# Altium project VisionBETA.PrjPcb (part 1 of 2)
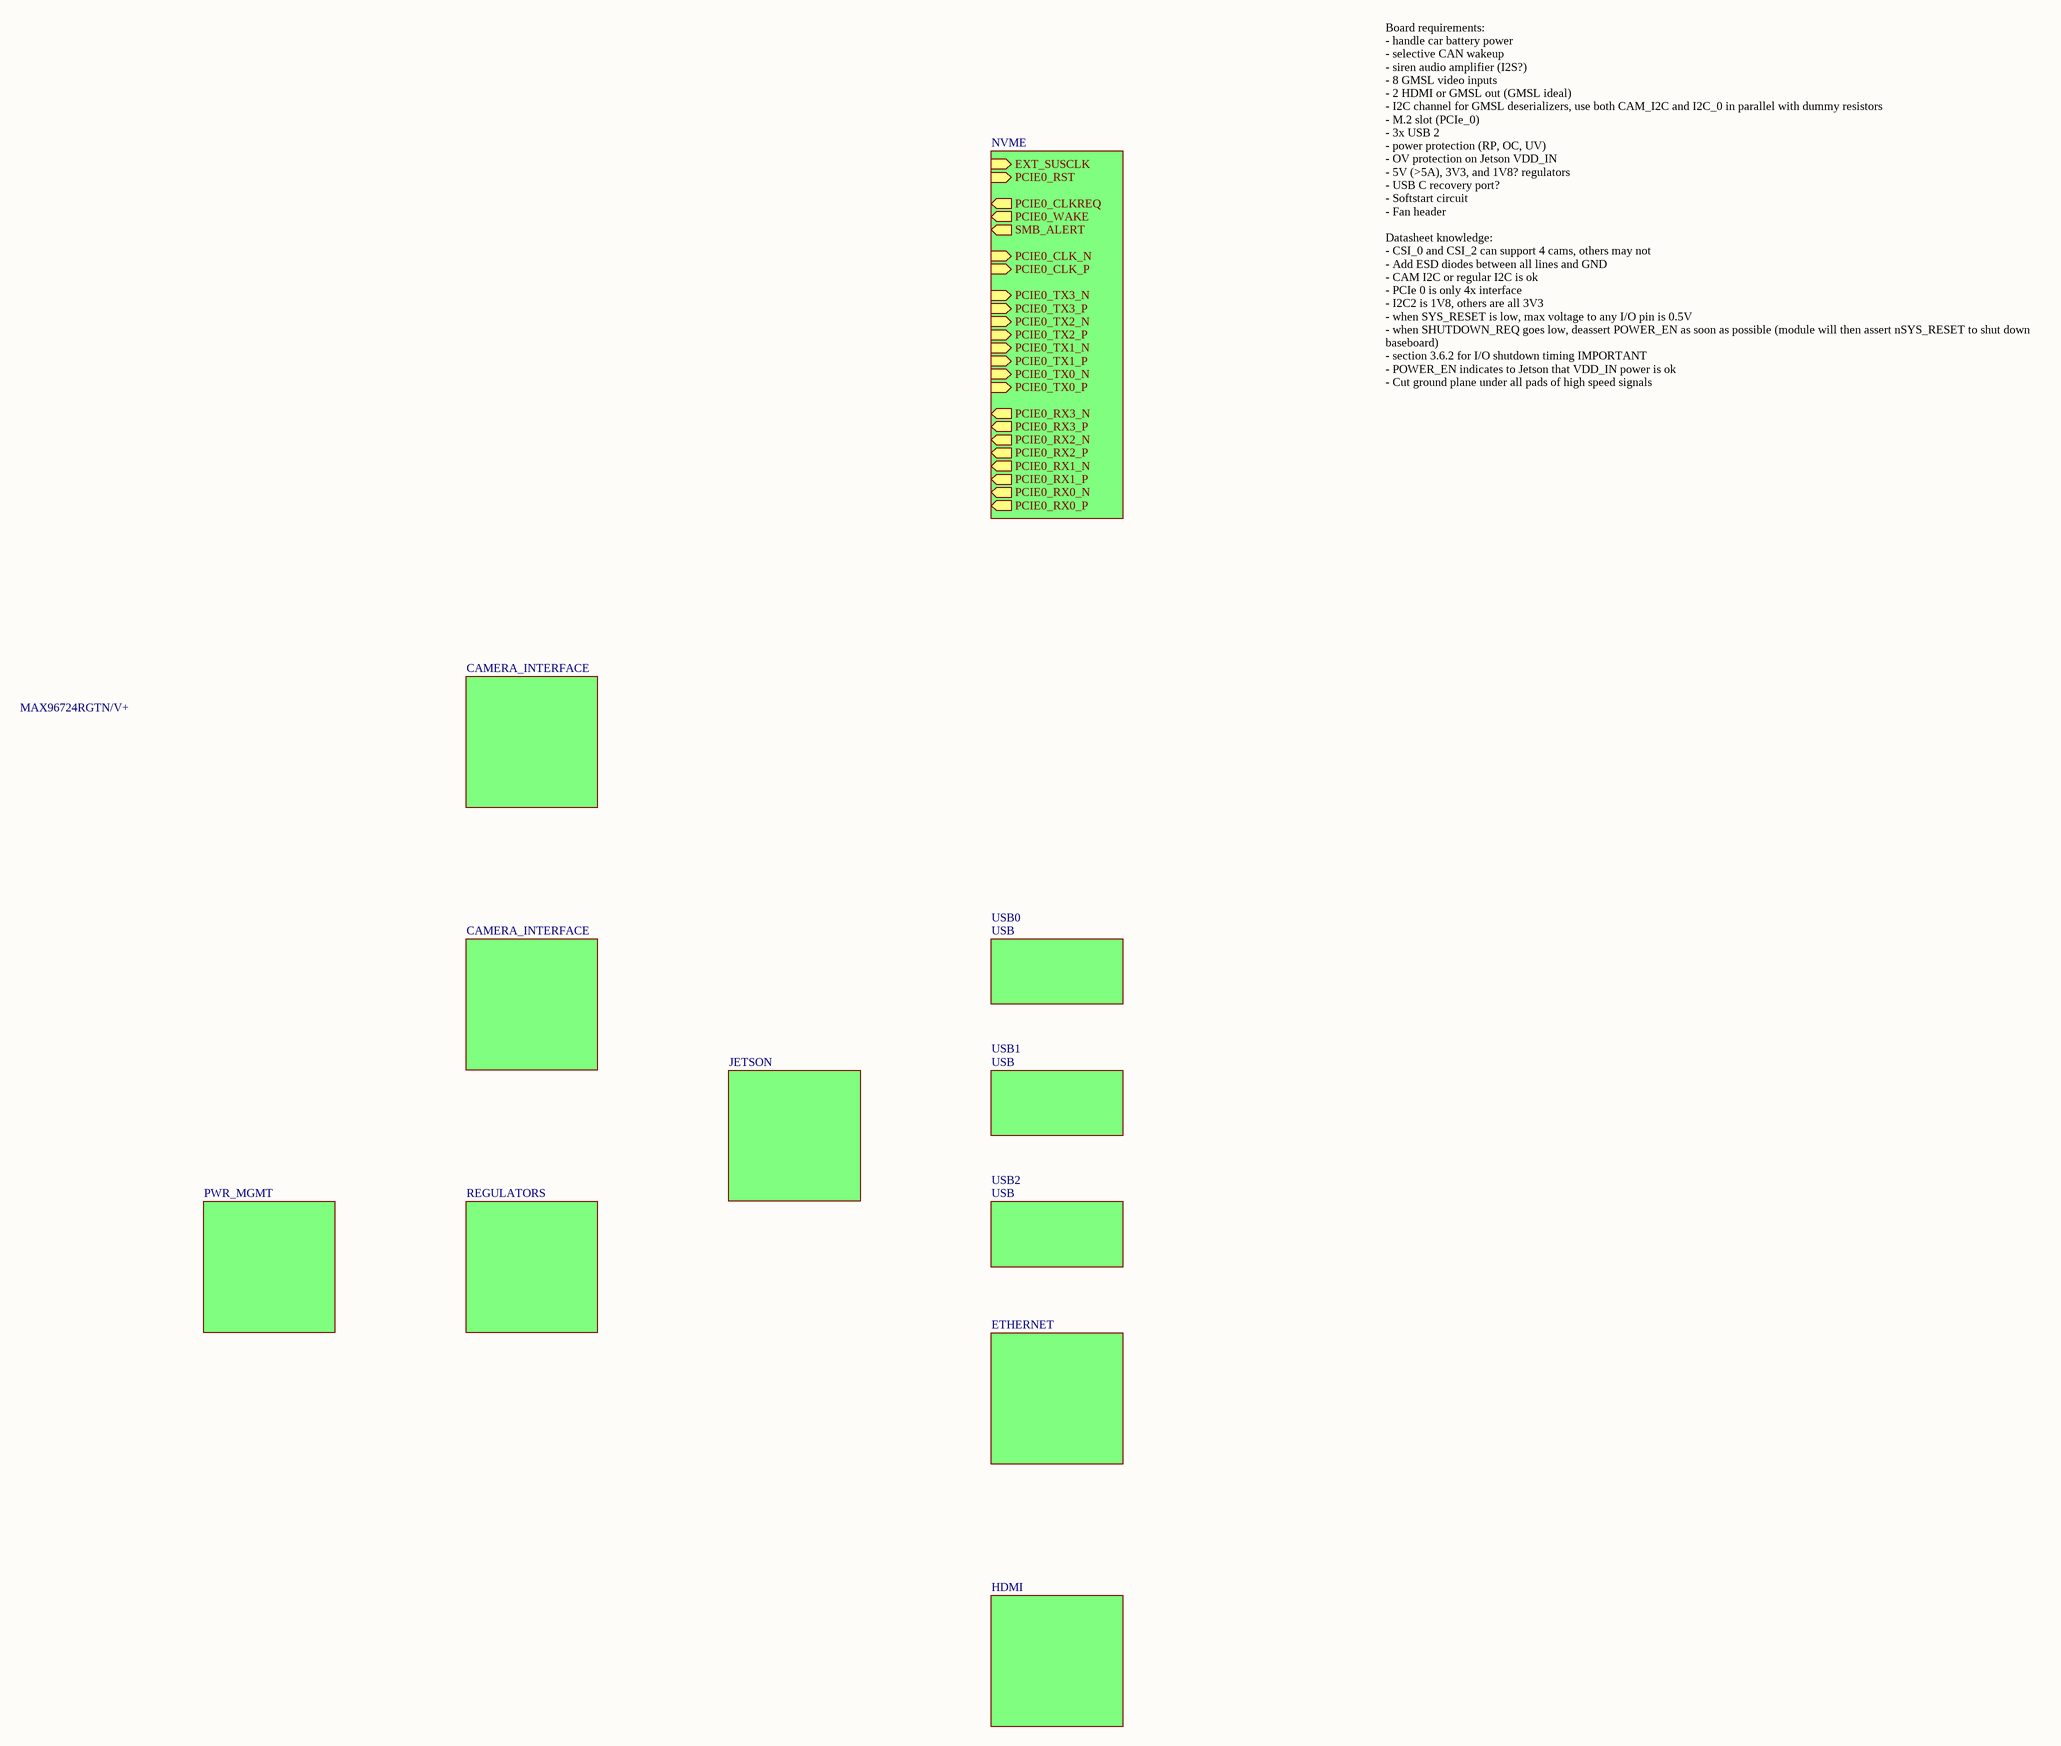
[diagram p0: VisionBETA.SchDoc]
6 sheets, 191 parts. Net scope: hierarchical (ports join the sheet entries above them; power ports are global).
Sheets:
  VisionBETA.SchDoc
    PWR_MGMT = PWR_MGMT.SchDoc
    CAMIF_0 = CAMERA_INTERFACE.SchDoc
    JETSON = JETSON.SchDoc
    USB0 = USB.SchDoc
    USB1 = USB.SchDoc
    USB2 = USB.SchDoc
    NVME = NVME.SchDoc
    CAMIF_1 = CAMERA_INTERFACE.SchDoc

## Sheet VisionBETA.SchDoc
size C; SheetNumber: 1; SheetTotal: 9

### Sub-sheets
CAMIF_0 = CAMERA_INTERFACE: no entries
CAMIF_1 = CAMERA_INTERFACE: no entries
ETH0 = ETHERNET (file not in this document): no entries
HDMI_0 = HDMI (file not in this document): no entries
JETSON = JETSON: no entries
NVME = NVME: EXT_SUSCLK (in), PCIE0_RST (in), PCIE0_CLKREQ (out), PCIE0_WAKE (out), SMB_ALERT (out), PCIE0_CLK_N (in), PCIE0_CLK_P (in), PCIE0_TX3_N (in), PCIE0_TX3_P (in), PCIE0_TX2_N (in), PCIE0_TX2_P (in), PCIE0_TX1_N (in), PCIE0_TX1_P (in), PCIE0_TX0_N (in), PCIE0_TX0_P (in), PCIE0_RX3_N (out), PCIE0_RX3_P (out), PCIE0_RX2_N (out), PCIE0_RX2_P (out), PCIE0_RX1_N (out), PCIE0_RX1_P (out), PCIE0_RX0_N (out), PCIE0_RX0_P (out)
PWR_MGMT = PWR_MGMT: no entries
REGULATORS = REGULATORS (file not in this document): no entries
USB0 = USB: no entries
USB1 = USB: no entries
USB2 = USB: no entries

### Notes on the sheet
- MAX96724RGTN/V+
- Board requirements:
  - handle car battery power
  - selective CAN wakeup
  - siren audio amplifier (I2S?)
  - 8 GMSL video inputs
  - 2 HDMI or GMSL out (GMSL ideal)
  - I2C channel for GMSL deserializers, use both CAM_I2C and I2C_0 in parallel with dummy resistors
  - M.2 slot (PCIe_0)
  - 3x USB 2
  - power protection (RP, OC, UV)
  - OV protection on Jetson VDD_IN
  - 5V (>5A), 3V3, and 1V8? regulators
  - USB C recovery port?
  - Softstart circuit
  - Fan header
  Datasheet knowledge:
  - CSI_0 and CSI_2 can support 4 cams, others may not
  - Add ESD diodes between all lines and GND
  - CAM I2C or regular I2C is ok
  - PCIe 0 is only 4x interface
  - I2C2 is 1V8, others are all 3V3
  - when SYS_RESET is low, max voltage to any I/O pin is 0.5V
  - when SHUTDOWN_REQ goes low, deassert POWER_EN as soon as possible (module will then assert nSYS_RESET to shut down baseboard)
  - section 3.6.2 for I/O shutdown timing IMPORTANT
  - POWER_EN indicates to Jetson that VDD_IN power is ok
  - Cut ground plane under all pads of high speed signals

## Sheet PWR_MGMT.SchDoc
size C; SheetNumber: 2; SheetTotal: 2
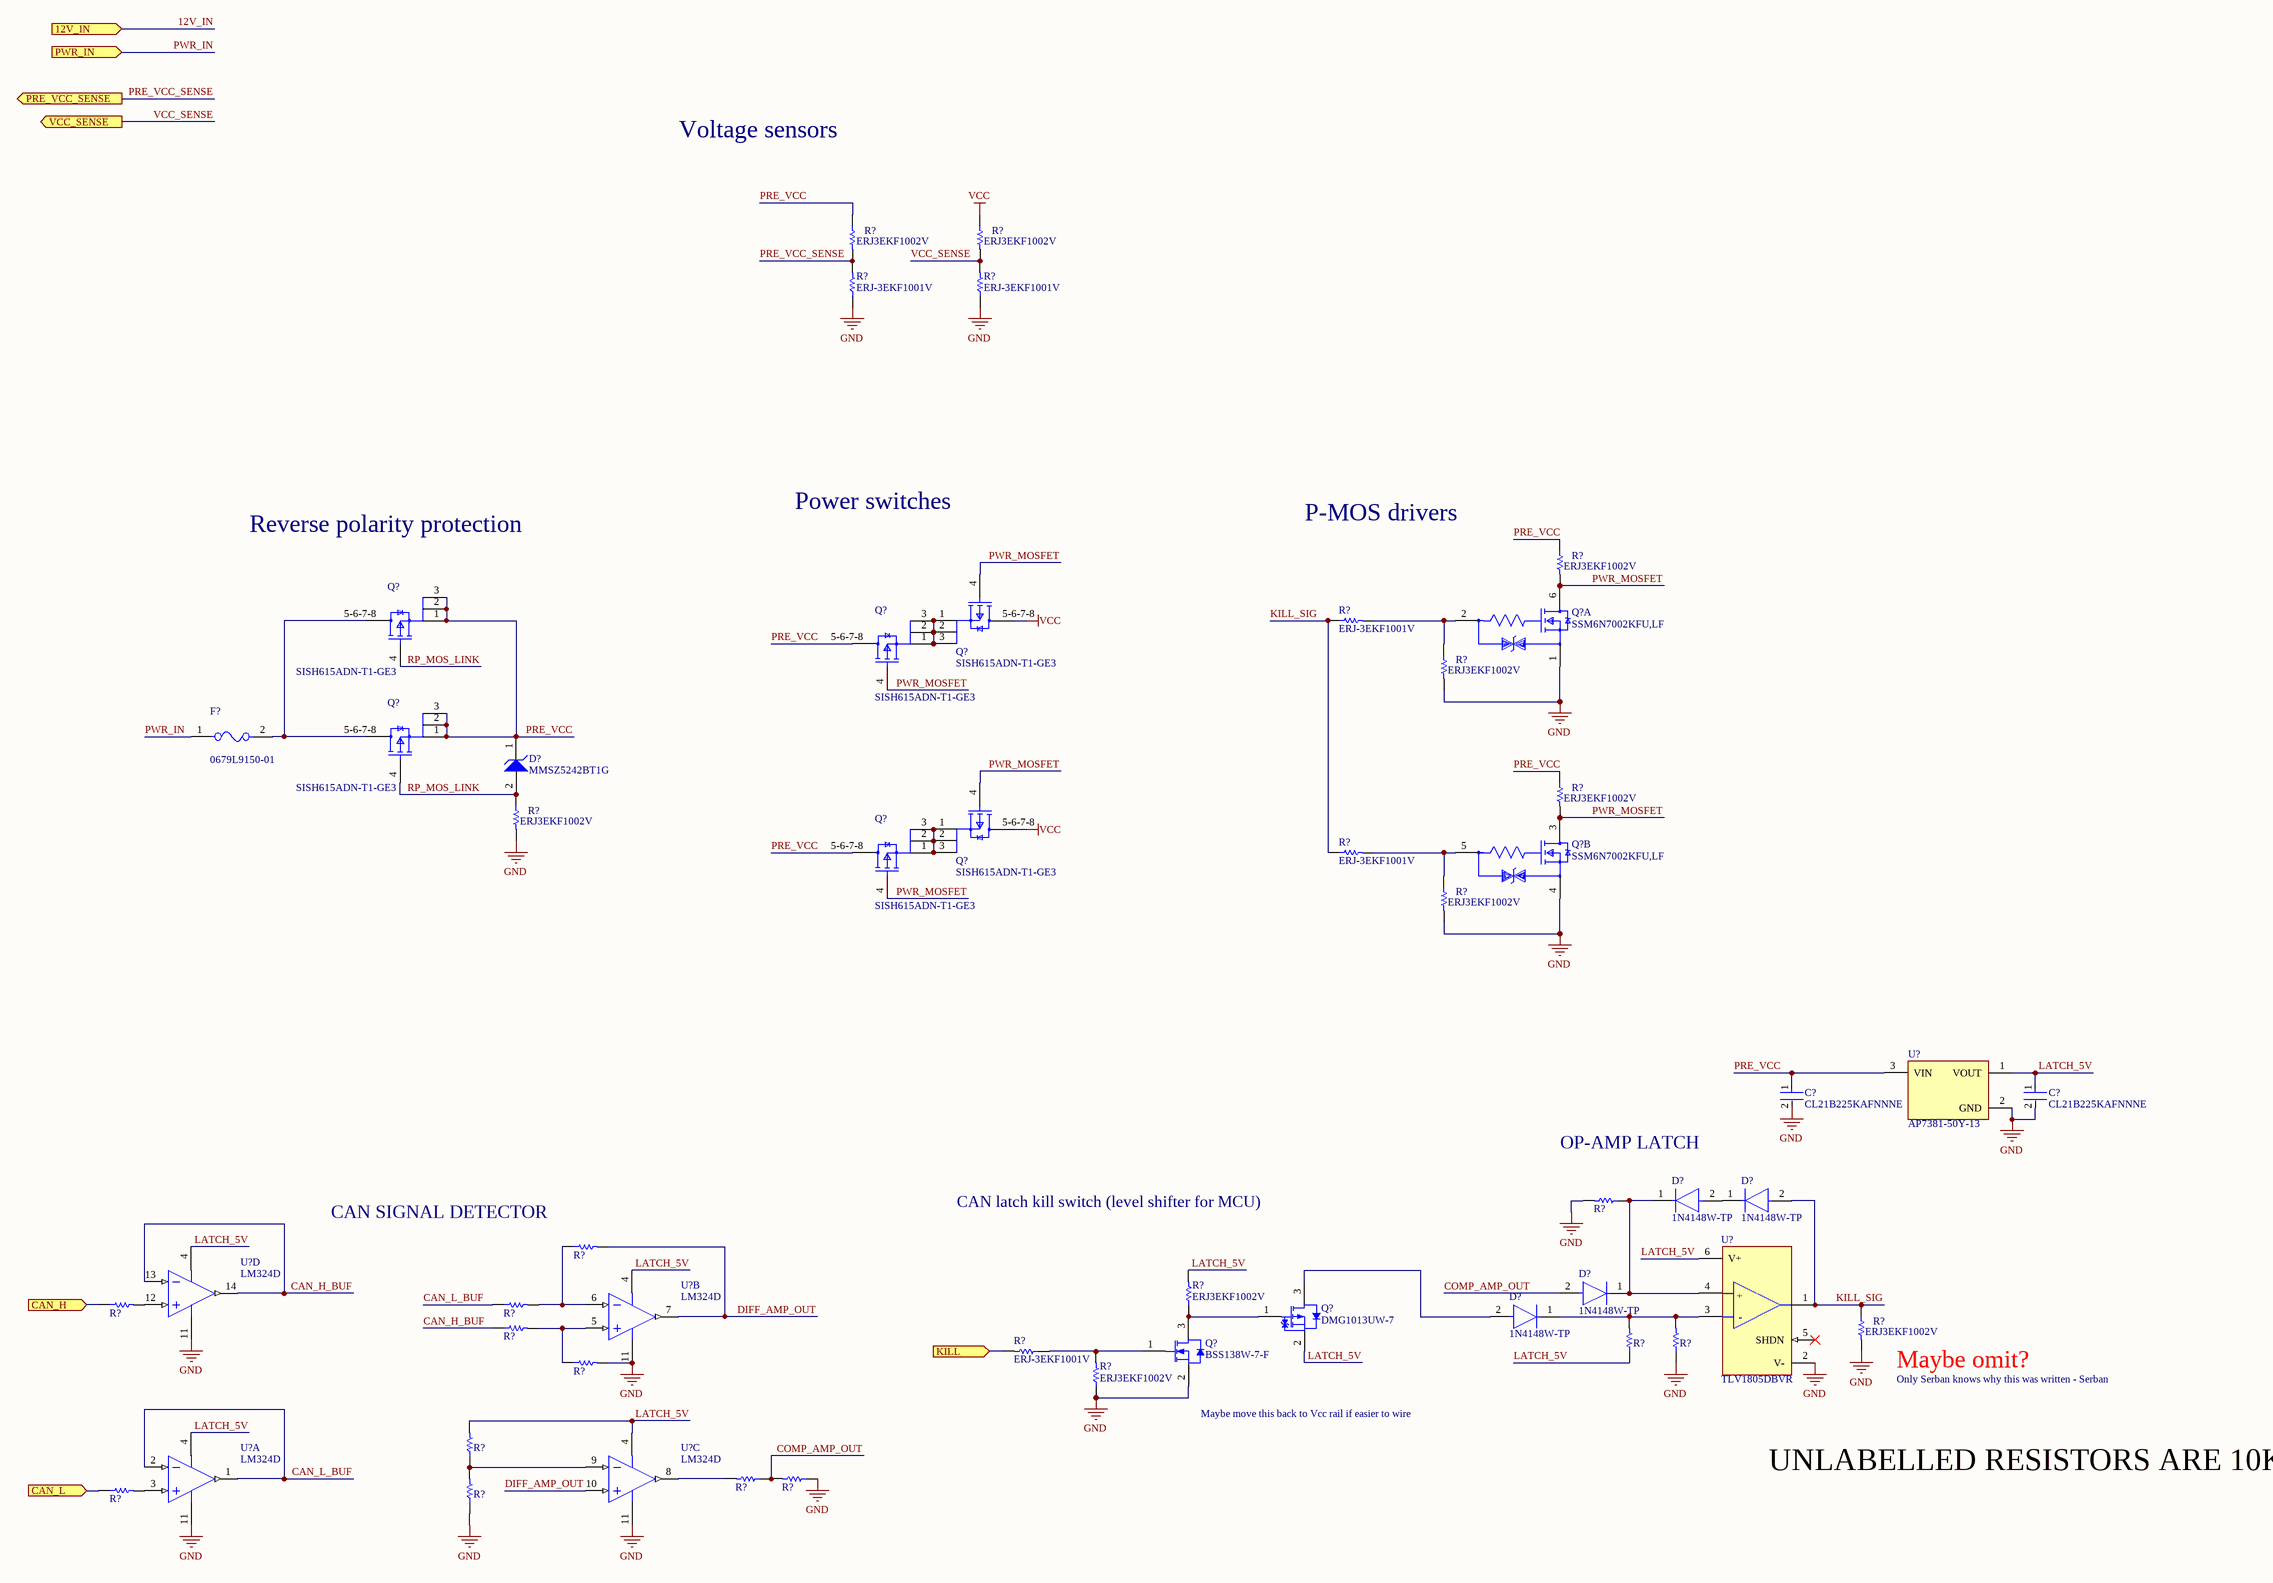
[diagram p1: PWR_MGMT.SchDoc]

### Parts
(Parts that share a designator on the sheet are numbered #1, #2 ... from top to bottom, then left to right.)
C?#1  CL21B225KAFNNNE  [FP-0805-L_2_01_0_2-W_1_25-IPC_B]
C?#2  CL21B225KAFNNNE  [FP-0805-L_2_01_0_2-W_1_25-IPC_B]
D?#1  MMSZ5242BT1G  [ONSC-SOD-123-2-425-04_V]
D?#2  1N4148W-TP  [FP-SOD-123-IPC_A]
D?#3  1N4148W-TP  [FP-SOD-123-IPC_A]
D?#4  1N4148W-TP  [FP-SOD-123-IPC_A]
D?#5  1N4148W-TP  [FP-SOD-123-IPC_A]
F?  0679L9150-01  [FP-0679L-MFG]
Q?#1  SISH615ADN-T1-GE3  [SISH615ADN-T1-GE3-Footprint-1]
Q?#2  SSM6N7002KFU,LF  [FP-SSOP6-P-0_65A-MFG]  (part A of 2)
Q?#3  SISH615ADN-T1-GE3  [SISH615ADN-T1-GE3-Footprint-1]
Q?#4  SISH615ADN-T1-GE3  [SISH615ADN-T1-GE3-Footprint-1]
Q?#5  SISH615ADN-T1-GE3  [SISH615ADN-T1-GE3-Footprint-1]
Q?#6  SISH615ADN-T1-GE3  [SISH615ADN-T1-GE3-Footprint-1]
Q?#7  SSM6N7002KFU,LF  [FP-SSOP6-P-0_65A-MFG]  (part B of 2)
Q?#8  SISH615ADN-T1-GE3  [SISH615ADN-T1-GE3-Footprint-1]
Q?#9  DMG1013UW-7  [DIOD-SOT323-3_V]
Q?#10  BSS138W-7-F  [DIOD-SOT323-3_V]
R?#1  ERJ3EKF1002V  [RESC1609X55X30LL15T15]
R?#2  ERJ3EKF1002V  [RESC1609X55X30LL15T15]
R?#3  ERJ-3EKF1001V  [RESC1608X55X30LL15T15]
R?#4  ERJ-3EKF1001V  [RESC1608X55X30LL15T15]
R?#5  ERJ3EKF1002V  [RESC1609X55X30LL15T15]
R?#6  ERJ-3EKF1001V  [RESC1608X55X30LL15T15]
R?#7  ERJ3EKF1002V  [RESC1609X55X30LL15T15]
R?#8  ERJ3EKF1002V  [RESC1609X55X30LL15T15]
R?#9  ERJ3EKF1002V  [RESC1609X55X30LL15T15]
R?#10  ERJ-3EKF1001V  [RESC1608X55X30LL15T15]
R?#11  ERJ3EKF1002V  [RESC1609X55X30LL15T15]
R?#12  ERJ3EKF1002V  [RESC1609X55X30LL15T15]  (value not drawn)
R?#13  ERJ3EKF1002V  [RESC1609X55X30LL15T15]  (value not drawn)
R?#14  ERJ3EKF1002V  [RESC1609X55X30LL15T15]  (value not drawn)
R?#15  ERJ3EKF1002V  [RESC1609X55X30LL15T15]  (value not drawn)
R?#16  ERJ3EKF1002V  [RESC1609X55X30LL15T15]
R?#17  ERJ3EKF1002V  [RESC1609X55X30LL15T15]
R?#18  ERJ3EKF1002V  [RESC1609X55X30LL15T15]  (value not drawn)
R?#19  ERJ3EKF1002V  [RESC1609X55X30LL15T15]  (value not drawn)
R?#20  ERJ3EKF1002V  [RESC1609X55X30LL15T15]  (value not drawn)
R?#21  ERJ3EKF1002V  [RESC1609X55X30LL15T15]  (value not drawn)
R?#22  ERJ-3EKF1001V  [RESC1608X55X30LL15T15]
R?#23  ERJ3EKF1002V  [RESC1609X55X30LL15T15]
R?#24  ERJ3EKF1002V  [RESC1609X55X30LL15T15]  (value not drawn)
R?#25  ERJ3EKF1002V  [RESC1609X55X30LL15T15]  (value not drawn)
R?#26  ERJ3EKF1002V  [RESC1609X55X30LL15T15]  (value not drawn)
R?#27  ERJ3EKF1002V  [RESC1609X55X30LL15T15]  (value not drawn)
R?#28  ERJ-3EKF1001V  [RESC1608X55X30LL15T15]  (value not drawn)
U?#1  AP7381-50Y-13  [FP-SOT89-MFG]
U?#2  TLV1805DBVR  [FP-DBV0006A-IPC_C]
U?#3  LM324D  [D0014A_L]  (part D of 4)
U?#4  LM324D  [D0014A_L]  (part B of 4)
U?#5  LM324D  [D0014A_L]  (part A of 4)
U?#6  LM324D  [D0014A_L]  (part C of 4)

### Ports
12V_IN (in), CAN_H (in), CAN_L (in), KILL (in), PRE_VCC_SENSE (out), PWR_IN (in), VCC_SENSE (out)

### Nets
GND: C?#1.2 C?#2.2 Q?#2.1(Source1) Q?#7.4(Source2) Q?#10.2(S) R?#3.1 R?#4.1 R?#7.2 R?#9.2 R?#11.2 R?#12.2 R?#17.2 R?#20.1 R?#21.2 R?#23.1 R?#26.1 R?#28.1 U?#1.2(GND) U?#2.2(V-) U?#3.11(GND) U?#4.11(GND) U?#5.11(GND) U?#6.11(GND)
VCC: Q?#1.5-6-7-8(D) Q?#6.5-6-7-8(D) R?#2.1
12V_IN: port 12V_IN
CAN_H_BUF: R?#18.1 U?#3.13(4IN-) U?#3.14(4OUT)
CAN_L_BUF: R?#15.1 U?#5.1(1OUT) U?#5.2(1IN-)
COMP_AMP_OUT: D?#4.2(A) R?#25.1 R?#26.2
DIFF_AMP_OUT: R?#13.2 U?#4.7(2OUT) U?#6.10(3IN+)
KILL_SIG: D?#3.2(A) R?#6.1 R?#10.1 R?#17.1 U?#2.1(OUT)
LATCH_5V: C?#2.1 Q?#9.2(S) R?#16.2 R?#19.1 R?#24.2 U?#1.1(VOUT) U?#2.6(V+) U?#3.4(VCC) U?#4.4(VCC) U?#5.4(VCC) U?#6.4(VCC)
PRE_VCC: C?#1.1 D?#1.1(K) Q?#3.1(S) Q?#3.2(S) Q?#3.3(S) Q?#4.5-6-7-8(D) Q?#5.1(S) Q?#5.2(S) Q?#5.3(S) Q?#8.5-6-7-8(D) R?#1.1 R?#5.1 R?#8.1 U?#1.3(VIN)
PRE_VCC_SENSE: R?#1.2 R?#3.2 ; port PRE_VCC_SENSE
PWR_IN: F?.1 ; port PWR_IN
PWR_MOSFET: Q?#1.4(G) Q?#2.6(Drain1) Q?#4.4(G) Q?#6.4(G) Q?#7.3(Drain2) Q?#8.4(G) R?#5.2 R?#8.2
RP_MOS_LINK: D?#1.2(A) Q?#3.4(G) Q?#5.4(G) R?#9.1
VCC_SENSE: R?#2.2 R?#4.2 ; port VCC_SENSE
NetD?#2_1: D?#2.1(C) D?#4.1(C) R?#12.1 U?#2.4(+IN)
NetD?#2_2: D?#2.2(A) D?#3.1(C)
NetD?#5_1: D?#5.1(C) R?#19.2 R?#20.2 U?#2.3(-IN)
NetD?#5_2: D?#5.2(A) Q?#9.3(D)
NetF?_2: F?.2 Q?#3.5-6-7-8(D) Q?#5.5-6-7-8(D)
NetQ?#1_1: Q?#1.1(S) Q?#1.2(S) Q?#1.3(S) Q?#4.1(S) Q?#4.2(S) Q?#4.3(S)
NetQ?#2_2: Q?#2.2(Gate1) R?#6.2 R?#7.1
NetQ?#6_1: Q?#6.1(S) Q?#6.2(S) Q?#6.3(S) Q?#8.1(S) Q?#8.2(S) Q?#8.3(S)
NetQ?#7_5: Q?#7.5(Gate2) R?#10.2 R?#11.1
NetQ?#9_1: Q?#9.1(G) Q?#10.3(D) R?#16.1
NetQ?#10_1: Q?#10.1(G) R?#22.1 R?#23.2
NetR?#13_1: R?#13.1 R?#15.2 U?#4.6(2IN-)
NetR?#14_1: R?#14.1 ; port CAN_H
NetR?#14_2: R?#14.2 U?#3.12(4IN+)
NetR?#18_2: R?#18.2 R?#21.1 U?#4.5(2IN+)
NetR?#22_2: R?#22.2 ; port KILL
NetR?#24_1: R?#24.1 R?#28.2 U?#6.9(3IN-)
NetR?#25_2: R?#25.2 U?#6.8(3OUT)
NetR?#27_1: R?#27.1 ; port CAN_L
NetR?#27_2: R?#27.2 U?#5.3(1IN+)

Not connected (* = marked no-connect by the designer): U?#2 5(SHDN)*

### Notes on the sheet
- Voltage sensors
- Power switches
- Reverse polarity protection
- P-MOS drivers
- OP-AMP LATCH
- CAN latch kill switch (level shifter for MCU)
- CAN SIGNAL DETECTOR
- (near R?#17) Maybe omit?
- Only Serban knows why this was written - Serban
- Maybe move this back to Vcc rail if easier to wire
- UNLABELLED RESISTORS ARE 10K
- (in symbol CMP-04896-000098-1) +; -

### Library data of the parts
C?#1 C?#2 = CMP-2007-04514-2: Voltage Rating (DC): 25V; Tolerance: 10%; Capacitance: 2.2uF; Dielectric: X7R; RoHS Compliant: Yes; Lead Free: Lead Free; Packaging: Tape and Reel; Case Code (Imperial): 0805; Case/Package: 0805; Contact Plating: Tin; Mount: Surface Mount; Construction: Flat; Voltage: 25V; REACH SVHC: No SVHC; Thickness: 0.06inch; Depth: 1.25mm; Max Operating Temperature: 125°C; Package Quantity: 3000; Width: 0.049inch; Height: 1.52mm; Case Code (Metric): 2012; Number of Pins: 2; Termination: SMD/SMT; Voltage Rating: 25V; Radiation Hardening: No; Series: FlEXITERM; Length: 2.01mm; Min Operating Temperature: -55°C
D?#1 = CMP-1060-00565-1: Zener Voltage Regulator, 500 mW, 2-Pin SOD-123, Pb-Free, Tape and Reel; Manufacturer: On Semiconductor; P Max (W): 0.5; VZ Typ (V): 12; PartNumber: MMSZ5242BT1G; PackageReference: SOD-123-2-425-04; ComponentLink3URL: http://www.onsemi.com/pub_link/Collateral/425-04.PDF; Mounting Technology: Surface Mount; ComponentLink2Description: Datasheet; ComponentLink1URL: http://www.onsemi.com/; ComponentLink3Description: Package Specification; PackageDescription: 2-Pin SOD, Body 1.6 x 2.69 mm; PackageVersion: Rev. G, 10/2009; ComponentLink1Description: Manufacturer URL; RoHS: Pb-Free; ComponentLink2URL: http://www.onsemi.com/pub_link/Collateral/MMSZ5221BT1-D.PDF; Packing: Tape and Reel; DatasheetVersion: Rev. 12
D?#2-D?#5 = CMP-2000-04993-2: DIODE GEN PURP 100V 150MA SOD123; Max Reverse Leakage Current: 5uA; Max Surge Current: 2A; Reverse Recovery Time: 4ns; Polarity: Standard; Capacitance: 4pF; Max Forward Surge Current (Ifsm): 1A; Element Configuration: Single; Power Dissipation: 400mW; Forward Voltage: 1V; Radiation Hardening: No; Lead Free: Lead Free; Max Reverse Voltage (DC): 100V; Current Rating: 150mA; Forward Current: 150mA; Packaging: Tape and Reel; Number of Pins: 2; Package Quantity: 3000; Max Operating Temperature: 150°C; Min Operating Temperature: -65°C; Average Rectified Current: 150mA; Recovery Time: 4ns; Output Current: 150mA; Peak Non-Repetitive Surge Current: 2A; Width: 1.8mm; Voltage Rating (DC): 100V; Height: 1.2mm; Max Repetitive Reverse Voltage (Vrrm): 100V; Mount: Surface Mount; Length: 2.85mm
F? = CMP-16042-000002-1: FUSE BRD MNT 15A 125VAC/VDC; Manufacturer: Bel Fuse; Max Fuse Ac Voltage: 125V; Fuse Blow Speed: Fast; Fuse I2T: 103.5A2Sec; Fuse Interrupt Ac Current: 50A; Automotive Grade: Grade 1; Value: 0.0038Ω; Fuse Interrupt Dc Current: 300A; Fuse Voltage Drop: 0.13V; Device Class L2: Fuses; ComponentLink2URL: https://www.belfuse.com/resources/CircuitProtection/datasheets/0679L%20Sep2016.pdf; Package: 0679L; Height: 2.79mm; Digikey Description: FUSE BRD MNT 15A 125VAC/VDC; Temperature Range High: +125°C; Device Class L3: unset; Octopart: https://octopart.com/0679l9150-01-bel+fuse-70850665; Temperature Range Low: -55°C; Fuse Current: 15A; Max Fuse Dc Voltage: 125V; Ipc Land Pattern Name: CAPC610254X254; Manufacturer Part Number: 0679L9150-01; Category: Fuse; Lead Free: Yes; Automotive: Yes; Resistance: 0.0038Ω; RoHS: TRUE; Device Class L1: Circuit Protection; ComponentLink2Description: Datasheet; Temperature: -55°C to +125°C; Voltage Rating: 125V
Q?#1 Q?#3-Q?#6 Q?#8 = CMP-013-00036-2: Trans MOSFET P-CH 20V 22.1A 8-Pin PowerPAK 1212 EP T/R
Q?#2 Q?#7 = CMP-35916-000009-1: MOSFET 2N-CH 60V 0.3A; Input Capacitance: 40pF; Continuous Drain Current (ID): 300mA; Max Power Dissipation: 285mW; FET Type: 2 N-Channel; Rds On Max: 1.5R; Mount: Surface Mount; Drain to Source Voltage (Vdss): 60V; Packaging: Tape and Reel
Q?#9 = CMP-2000-06170-1: P-Channel Enhancement Mode MOSFET, 310 mW, 20 V, -55 to 150 degC, 3-Pin SOT-323, RoHS, Tape and Reel; Manufacturer: Diodes Inc; Qg Gate Charge: 0.622nC; Drain-Source On Resistance-Max: 750mO; Rated Power Dissipation: 310mW; Drain-to-Source Voltage [Vdss]: 20V; Package Reference: SOT323; Datasheet Version: Rev. 3-2, 09/2013; Package Description: 3-Pin Small Outline Transistor, Body 2 x 1.25 mm, Pitch 0.65 mm; Mounting Technology: SurfaceMount; Manufacturer URL: http://www.diodes.com/; Datasheet URL: http://www.diodes.com/_files/datasheets/ds31861.pdf; Channel Type: P-Channel
Q?#10 = CMP-2000-05968-1: N-Channel Enhancement Mode Mosfet, 50 V, 200 mA, -55 to 150 degC, 6-Pin SOT-323, RoHS, Tape and Reel; Typical Turn-Off Delay Time: 20ns; Number of Channels: 1Channel; Type: EnhancementModeFieldEffectTransistor; Brand: DiodesIncorporated; Vds - Drain-Source Breakdown Voltage: 75V; Vgs - Gate-Source Voltage: 20V; Rds On - Drain-Source Resistance: 1.4Ohms; Transistor Type: 1N-Channel; Configuration: Single; Unit Weight: 0.000212oz; Pd - Power Dissipation: 200mW; Id - Continuous Drain Current: 200mA; Forward Transconductance - Min: 0.1S; Manufacturer URL: http://www.diodes.com/; Series: BSS138; Package Description: 3-Pin Small Outline Transistor, Body 2 x 1.25 mm, Pitch 0.65 mm; Mounting Technology: SurfaceMount; Product Category: MOSFET; RoHS: True; Maximum Operating Temperature: +150C; Height: 1mm; Length: 2.2mm; Technology: Si; Width: 1.35mm; Datasheet URL: http://www.diodes.com/_files/datasheets/ds30206.pdf; Manufacturer: DiodesIncorporated; Package / Case: SOT-323-3; Typical Turn-On Delay Time: 20ns; Transistor Polarity: N-Channel; Factory Pack Quantity: 3000; Packaging: Reel; Product: MOSFETSmallSignal; Datasheet Version: Rev. 11-2, 09/2013; Package Reference: SOT323; Minimum Operating Temperature: -55C; Mounting Style: SMD/SMT; Channel Mode: Enhancement
R?#1 R?#2 R?#5 R?#7-R?#9 R?#11-R?#21 R?#23-R?#27 = CMP-1012-00623-3: Chip Resistor, 10 KOhm, +/- 1%, 0.1 W, -55 to 155 degC, 0603 (1608 Metric), RoHS, Tape and Reel; Manufacturer: Panasonic; Voltage Rating: 75V; Case\/Package: 0603; Power Rating: 100mW; Resistance: 10KOhm; Temperature Coefficient: 100ppm\/degreesC; Number of Pins: 2; Package Reference: 603; Depth: 0.8mm; Mount: SurfaceMount; Package Description: 2-Pin Surface Mount Device, Body 1.6 x 0.85 mm; Datasheet Version: 02/2017; Length: 1.6mm; Lead Free: LeadFree; Height: 0.45mm; Number of Terminations: 2; Max Power Dissipation: 100mW; Min Operating Temperature: -55degC; Datasheet URL: https://industrial.panasonic.com/cdbs/www-data/pdf/RDA0000/AOA0000C304.pdf; Termination: SMD/SMT; Case Code (Metric): 1608; Case Code (Imperial): 0603; Tolerance: 1%; Max Operating Temperature: 155degC; RoHSCompliant: true; Voltage Rating (DC): 75V; Radiation Hardening: No; Packaging: TapeandReel; Composition: ThickFilm; Mounting Technology: SurfaceMount; Manufacturer URL: http://www.panasonic.com/; Width: 0.031inch; REACH SVHC: NoSVHC; Contact Plating: Tin; Military Standard: Not; Package Quantity: 1
R?#3 R?#4 R?#6 R?#10 R?#22 R?#28 = CMP-2000-00180-1: Manufacturer: Panasonic; Part Number: ERJ-3EKF1001V
U?#1 = CMP-12756-000009-1: IC REG LINEAR 5V 150MA SOT89; Manufacturer: Diodes Inc.; Output Type: Fixed; Min Supply Voltage: 3.3V; Max Junction Temp: +125°C; Max Supply Voltage: 40V; Nominal Supply Current: 2.5-25uA; Number Of Outputs: 1; Dropout Voltage: 1000mV; Manufacturer Part Number: AP7381-50Y-13; RoHS: TRUE; Digikey Description: IC REG LINEAR 5V 150MA SOT89; Output Voltage: 5V; Footprint Url: https://www.diodes.com/assets/Package-Files/SOT89.pdf; Category: IC; Temperature: -40°C to +125°C; ComponentLink2Description: Datasheet; Package: SOT89; Temperature Range Low: -40°C; Temperature Range High: +125°C; ComponentLink2URL: https://www.diodes.com/assets/Datasheets/AP7381.pdf; Device Class L1: Integrated Circuits (ICs); Automotive: No; Output Current: 150mA; Ambient Temperature Range High: +85°C; Octopart: https://octopart.com/ap7381-50y-13-diodes+inc.-87775116; Lead Free: Yes; Device Class L2: Power Management ICs; Height: 1.6mm; Device Class L3: Voltage Regulators - Linear; Ambient Temperature Range Low: -40°C
U?#2 = CMP-04896-000098-1: 40V, RAIL-TO-RAIL INPUT, PUSH-PU
U?#3-U?#6 = CMP-2000-06547-1: Quadruple Operational Amplifier, 0.5 V/us, 1.2 MHz, 3 to 32 V, 0 to 70 degC, 14-Pin SOIC (D), Green (RoHS & no Sb/Br), Tube; Manufacturer: Texas Instruments; Unity Gain Bandwidth Product: 1.2MHz; Input Offset Voltage: 7mV; Dual Supply Voltage (Max): ±16V; Single Supply Voltage (Min): 3V; Single Supply Voltage (Max): 32V; Voltage Gain in dB: 100dB; Power Supply Requirement: Single/Dual; Input Bias Current: 250nA; Dual Supply Voltage (Min): ±1.5V; Single Supply Voltage (Typ): 5/9/12/15/18/24/28V; Dual Supply Voltage (Typ): ±3/±5/±9/±12/±15V; Number of  Elements: 4; Common Mode Rejection Ratio: 65dB; Datasheet Version: Rev. W, 03/2015; Technology: Bipolar; Shut Down Feature: No; Package Reference: D0014A; Type: GeneralPurposeAmplifier; Pin Count: 14; Package Type: SOIC; Rail/Rail I/O Type: No; Manufacturer URL: http://www.ti.com/; Package Description: 14-Pin Small Outline Integrated Circuit, Body 8.65 x 3.9 mm, Pitch 1.27 mm; Operating Temperature Classification: Commercial; Datasheet URL: http://www.ti.com/lit/ds/symlink/lm324.pdf; Slew Rate: 0.5V/us; Package URL: http://www.ti.com/lit/ml/mpds177g/mpds177g.pdf; Mounting: SurfaceMount; Packaging: Rail/Tube; Mounting Technology: SurfaceMount; Operating Temp Range: 0Cto70C

## Sheet CAMERA_INTERFACE.SchDoc
size C; SheetNumber: 4; SheetTotal: 8
Used 2 times, as channels CAMIF_0, CAMIF_1. Parts and nets are listed once, with the designators drawn on the sheet.
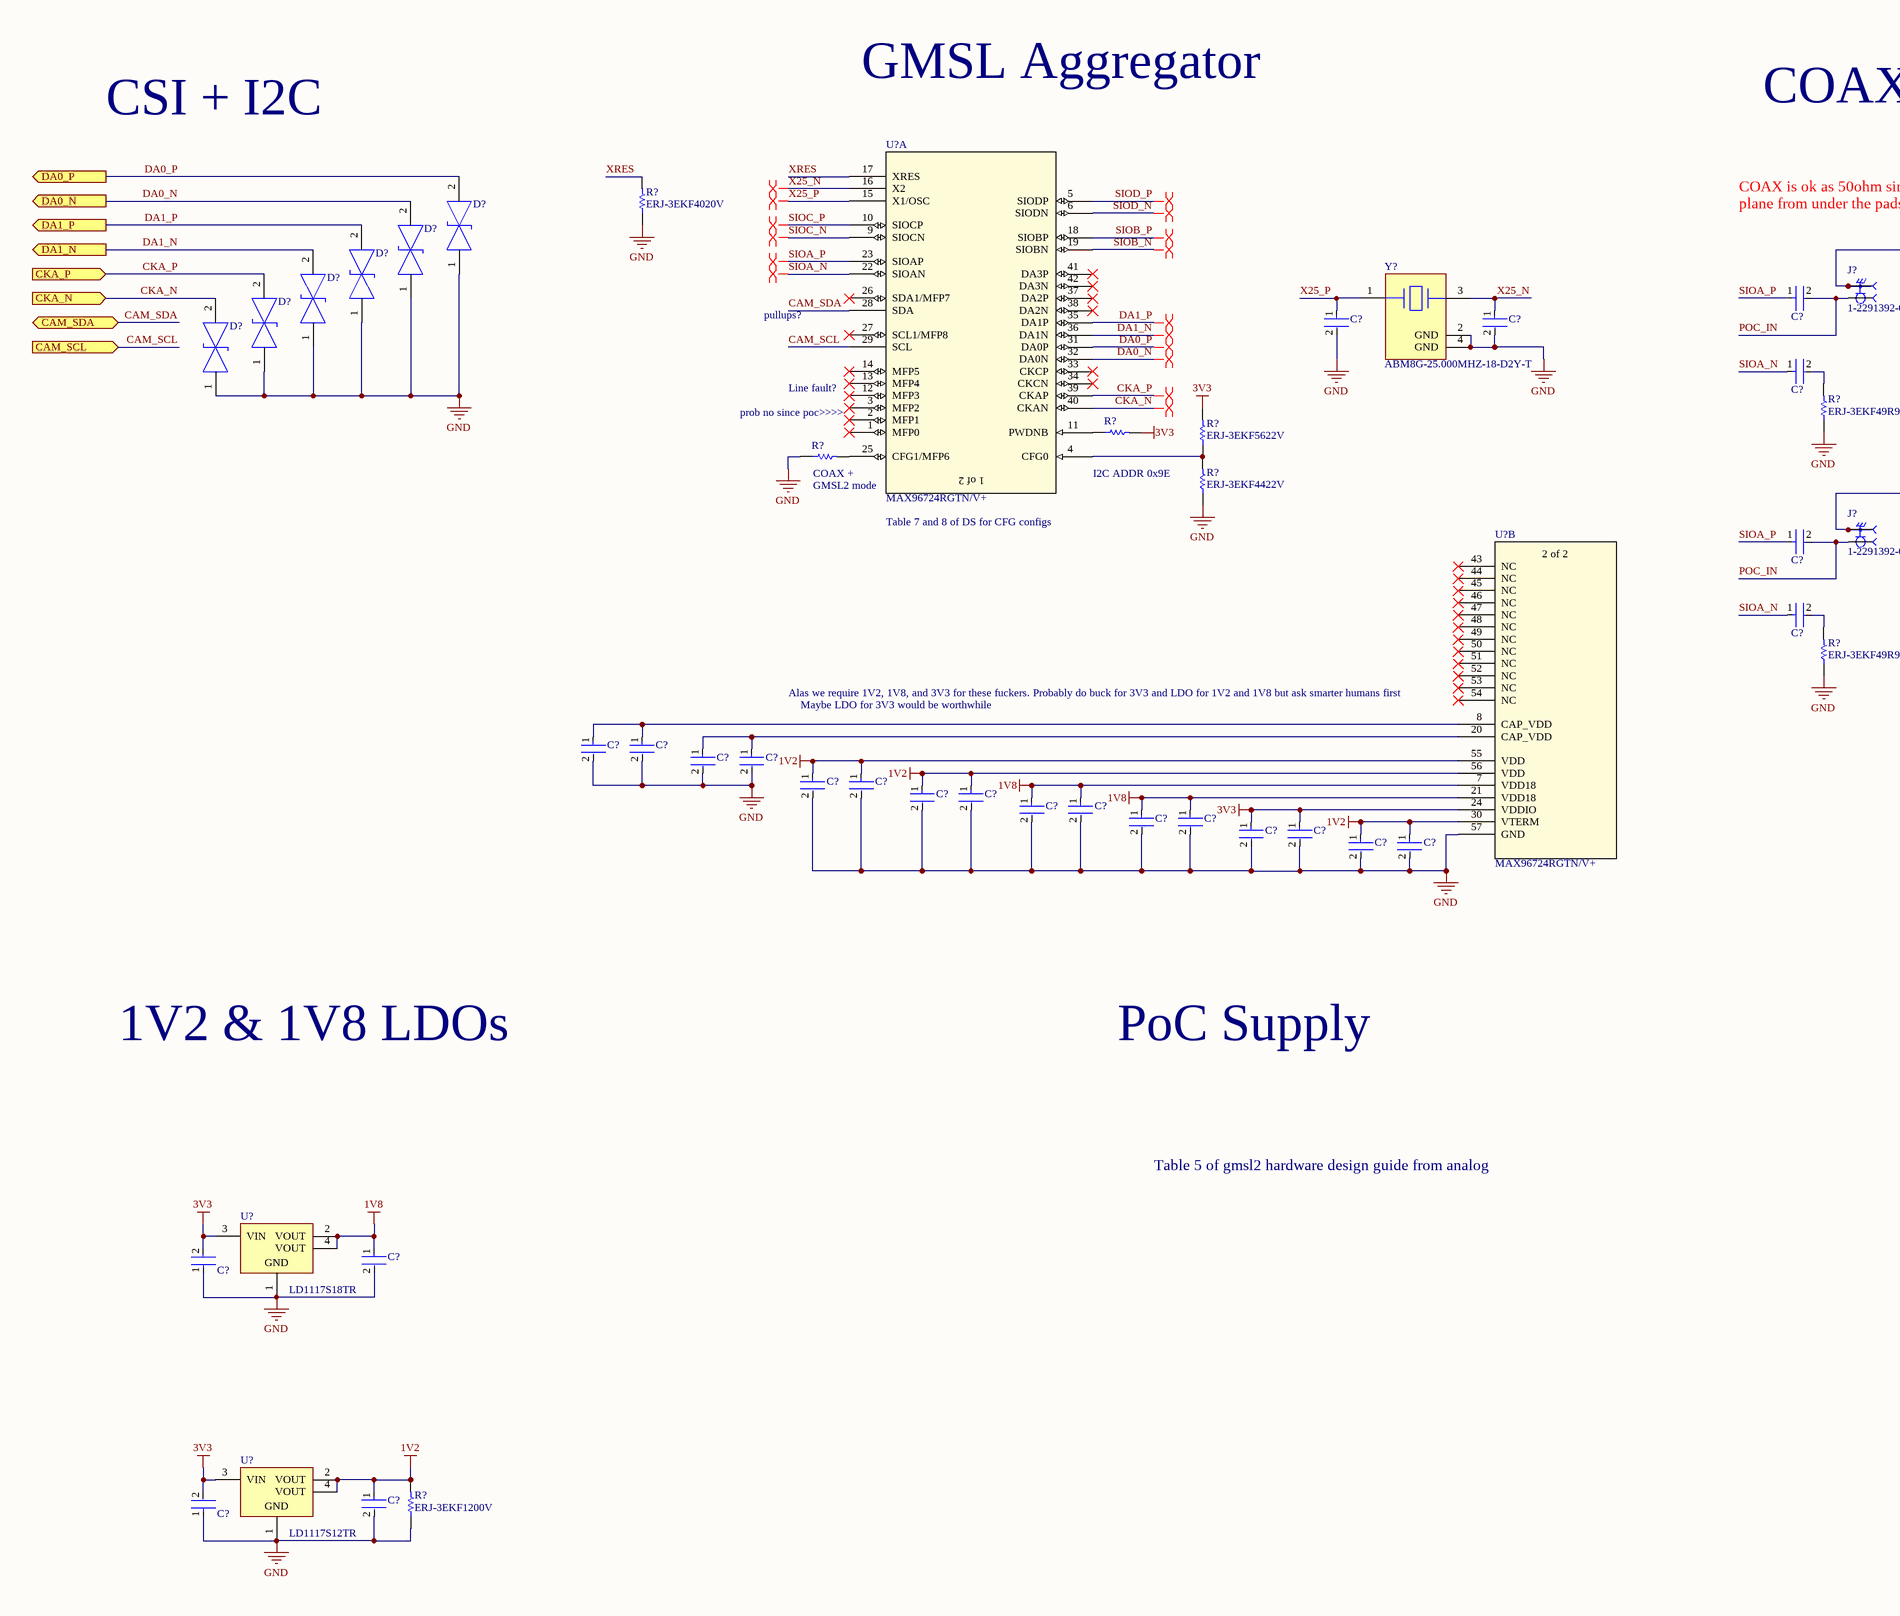
[diagram p2: CAMERA_INTERFACE.SchDoc, left]
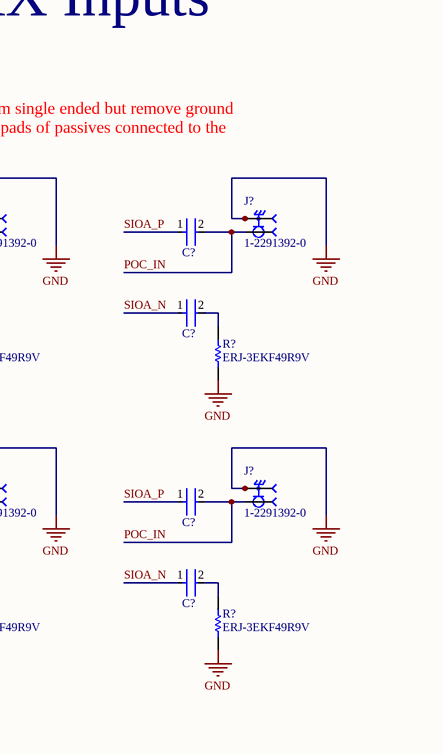
[diagram p3: CAMERA_INTERFACE.SchDoc, right]

### Parts
(Parts that share a designator on the sheet are numbered #1, #2 ... from top to bottom, then left to right.)
C?#1  C1005X7R1H104K050BB  [FP-C1005-050-0_05-IPC_C]  (value not drawn)
C?#2  C1005X7R1H104K050BB  [FP-C1005-050-0_05-IPC_C]  (value not drawn)
C?#3  C0603C300J5GACTU  [FP-C0603C-CF-MFG]  (value not drawn)
C?#4  C0603C300J5GACTU  [FP-C0603C-CF-MFG]  (value not drawn)
C?#5  C1005X7R1H104K050BB  [FP-C1005-050-0_05-IPC_C]  (value not drawn)
C?#6  C1005X7R1H104K050BB  [FP-C1005-050-0_05-IPC_C]  (value not drawn)
C?#7  C1005X7R1H104K050BB  [FP-C1005-050-0_05-IPC_C]  (value not drawn)
C?#8  C1005X7R1H104K050BB  [FP-C1005-050-0_05-IPC_C]  (value not drawn)
C?#9  C1005X7R1H104K050BB  [FP-C1005-050-0_05-IPC_C]  (value not drawn)
C?#10  C1005X7R1H104K050BB  [FP-C1005-050-0_05-IPC_C]  (value not drawn)
C?#11  GRM188R60J106ME47D  [FP-GRM188-0_1-e0_2_0_55-IPC_A]  (value not drawn)
C?#12  CC0603KRX7R8BB103  [FP-CC0603-DA-MFG]  (value not drawn)
C?#13  GRM188R60J106ME47D  [FP-GRM188-0_1-e0_2_0_55-IPC_A]  (value not drawn)
C?#14  CC0603KRX7R8BB103  [FP-CC0603-DA-MFG]  (value not drawn)
C?#15  GRM188R60J106ME47D  [FP-GRM188-0_1-e0_2_0_55-IPC_A]  (value not drawn)
C?#16  CC0603KRX7R8BB103  [FP-CC0603-DA-MFG]  (value not drawn)
C?#17  GRM188R60J106ME47D  [FP-GRM188-0_1-e0_2_0_55-IPC_A]  (value not drawn)
C?#18  CC0603KRX7R8BB103  [FP-CC0603-DA-MFG]  (value not drawn)
C?#19  GRM188R60J106ME47D  [FP-GRM188-0_1-e0_2_0_55-IPC_A]  (value not drawn)
C?#20  CC0603KRX7R8BB103  [FP-CC0603-DA-MFG]  (value not drawn)
C?#21  GRM188R60J106ME47D  [FP-GRM188-0_1-e0_2_0_55-IPC_A]  (value not drawn)
C?#22  CC0603KRX7R8BB103  [FP-CC0603-DA-MFG]  (value not drawn)
C?#23  GRM188R60J106ME47D  [FP-GRM188-0_1-e0_2_0_55-IPC_A]  (value not drawn)
C?#24  CC0603KRX7R8BB103  [FP-CC0603-DA-MFG]  (value not drawn)
C?#25  GRM188R60J106ME47D  [FP-GRM188-0_1-e0_2_0_55-IPC_A]  (value not drawn)
C?#26  CC0603KRX7R8BB103  [FP-CC0603-DA-MFG]  (value not drawn)
C?#27  GRM188R60J106ME47D  [FP-GRM188-0_1-e0_2_0_55-IPC_A]  (value not drawn)
C?#28  C1005X7R1H104K050BB  [FP-C1005-050-0_05-IPC_C]  (value not drawn)
C?#29  GRM188R60J106ME47D  [FP-GRM188-0_1-e0_2_0_55-IPC_A]  (value not drawn)
C?#30  C1005X7R1H104K050BB  [FP-C1005-050-0_05-IPC_C]  (value not drawn)
D?#1  ESD231B1W0201E6327XTSA1  [FP-SG-WLL-2-MFG]  (value not drawn)
D?#2  ESD231B1W0201E6327XTSA1  [FP-SG-WLL-2-MFG]  (value not drawn)
D?#3  ESD231B1W0201E6327XTSA1  [FP-SG-WLL-2-MFG]  (value not drawn)
D?#4  ESD231B1W0201E6327XTSA1  [FP-SG-WLL-2-MFG]  (value not drawn)
D?#5  ESD231B1W0201E6327XTSA1  [FP-SG-WLL-2-MFG]  (value not drawn)
D?#6  ESD231B1W0201E6327XTSA1  [FP-SG-WLL-2-MFG]  (value not drawn)
J?#1  1-2291392-0  [1-2291392-0-Footprint-1]
J?#2  1-2291392-0  [1-2291392-0-Footprint-1]
J?#3  1-2291392-0  [1-2291392-0-Footprint-1]
J?#4  1-2291392-0  [1-2291392-0-Footprint-1]
R?#1  ERJ-3EKF4020V  [RESC1608X55X30LL15T15]
R?#2  ERJ-3EKF49R9V  [RESC1608X55X30ML15T15]
R?#3  ERJ-3EKF49R9V  [RESC1608X55X30ML15T15]
R?#4  ERJ3EKF1002V  [RESC1609X55X30LL15T15]  (value not drawn)
R?#5  ERJ-3EKF5622V  [RESC1608X55X30LL15T15]
R?#6  ERJ3EKF1002V  [RESC1609X55X30LL15T15]  (value not drawn)
R?#7  ERJ-3EKF4422V  [RESC1608X55X30ML15T15]
R?#8  ERJ-3EKF49R9V  [RESC1608X55X30ML15T15]
R?#9  ERJ-3EKF49R9V  [RESC1608X55X30ML15T15]
R?#10  ERJ-3EKF1200V  [RESC1609X55X30ML15T15]
U?#1  MAX96724RGTN/V+  [QFN50P800X800X80_HS-57N]  (part A of 2)
U?#2  MAX96724RGTN/V+  [QFN50P800X800X80_HS-57N]  (part B of 2)
U?#3  LD1117S18TR  [SOT-223_M]
U?#4  LD1117S12TR  [SOT-223_M]
Y?  ABM8G-25.000MHZ-18-D2Y-T  [FP-ABM8G-MFG]

### Ports
CAM_SCL (in), CAM_SDA (bidir), CKA_N (in), CKA_P (in), DA0_N (out), DA0_P (out), DA1_N (out), DA1_P (out)

### Nets
1V2: C?#15.1 C?#16.1 C?#17.1 C?#18.1 C?#25.1 C?#26.1 C?#29.1 R?#10.2 U?#2.30(VTERM) U?#2.55(VDD) U?#2.56(VDD) U?#4.2(VOUT) U?#4.4(VOUT)
1V8: C?#19.1 C?#20.1 C?#21.1 C?#22.1 C?#27.1 U?#2.7(VDD18) U?#2.21(VDD18) U?#3.2(VOUT) U?#3.4(VOUT)
3V3: C?#23.1 C?#24.1 C?#28.2 C?#30.2 R?#4.2 R?#5.2 U?#2.24(VDDIO) U?#3.3(VIN) U?#4.3(VIN)
GND: C?#3.2 C?#4.2 C?#11.2 C?#12.2 C?#13.2 C?#14.2 C?#15.2 C?#16.2 C?#17.2 C?#18.2 C?#19.2 C?#20.2 C?#21.2 C?#22.2 C?#23.2 C?#24.2 C?#25.2 C?#26.2 C?#27.2 C?#28.1 C?#29.2 C?#30.1 D?#1.1 D?#2.1 D?#3.1 D?#4.1 D?#5.1 D?#6.1 J?#1.S1 J?#1.S2 J?#1.S3 J?#1.S4 J?#2.S1 J?#2.S2 J?#2.S3 J?#2.S4 J?#3.S1 J?#3.S2 J?#3.S3 J?#3.S4 J?#4.S1 J?#4.S2 J?#4.S3 J?#4.S4 R?#1.1 R?#2.1 R?#3.1 R?#6.1 R?#7.1 R?#8.1 R?#9.1 R?#10.1 U?#2.57(GND) U?#3.1(GND) U?#4.1(GND) Y?.2(GND) Y?.4(GND)
CAM_SCL: U?#1.29(SCL) ; port CAM_SCL
CAM_SDA: U?#1.28(SDA) ; port CAM_SDA
CKA_N: D?#6.2 U?#1.40(CKAN) ; port CKA_N
CKA_P: D?#5.2 U?#1.39(CKAP) ; port CKA_P
DA0_N: D?#2.2 U?#1.32(DA0N) ; port DA0_N
DA0_P: D?#1.2 U?#1.31(DA0P) ; port DA0_P
DA1_N: D?#4.2 U?#1.36(DA1N) ; port DA1_N
DA1_P: D?#3.2 U?#1.35(DA1P) ; port DA1_P
POC_IN: C?#1.2 C?#2.2 C?#7.2 C?#8.2 J?#1.1 J?#2.1 J?#3.1 J?#4.1
SIOA_N: C?#5.1 C?#6.1 C?#9.1 C?#10.1 U?#1.22(SIOAN)
SIOA_P: C?#1.1 C?#2.1 C?#7.1 C?#8.1 U?#1.23(SIOAP)
SIOB_N: U?#1.19(SIOBN)
SIOB_P: U?#1.18(SIOBP)
SIOC_N: U?#1.9(SIOCN)
SIOC_P: U?#1.10(SIOCP)
SIOD_N: U?#1.6(SIODN)
SIOD_P: U?#1.5(SIODP)
X25_N: C?#4.1 U?#1.16(X2) Y?.3
X25_P: C?#3.1 U?#1.15(X1/OSC) Y?.1
XRES: R?#1.2 U?#1.17(XRES)
NetC?#5_2: C?#5.2 R?#2.2
NetC?#6_2: C?#6.2 R?#3.2
NetC?#9_2: C?#9.2 R?#8.2
NetC?#10_2: C?#10.2 R?#9.2
NetC?#11_1: C?#11.1 C?#12.1 U?#2.8(CAP_VDD)
NetC?#13_1: C?#13.1 C?#14.1 U?#2.20(CAP_VDD)
NetR?#4_1: R?#4.1 U?#1.11(PWDNB)
NetR?#5_1: R?#5.1 R?#7.2 U?#1.4(CFG0)
NetR?#6_2: R?#6.2 U?#1.25(CFG1/MFP6)

Not connected (* = marked no-connect by the designer): U?#1 1(MFP0)* 2(MFP1)* 3(MFP2)* 12(MFP3)* 13(MFP4)* 14(MFP5)* 26(SDA1/MFP7)* 27(SCL1/MFP8)* 33(CKCP)* 34(CKCN)* 37(DA2P)* 38(DA2N)* 41(DA3P)* 42(DA3N)*; U?#2 43(NC)* 44(NC)* 45(NC)* 46(NC)* 47(NC)* 48(NC)* 49(NC)* 50(NC)* 51(NC)* 52(NC)* 53(NC)* 54(NC)*

### Channels
CAMIF_0: designators C?=C?_CAMIF_0#3 C?=C?_CAMIF_0#4 C?=C?_CAMIF_0#26 C?=C?_CAMIF_0#25 C?=C?_CAMIF_0#24 C?=C?_CAMIF_0#23 C?=C?_CAMIF_0#22 C?=C?_CAMIF_0#21 C?=C?_CAMIF_0#20 C?=C?_CAMIF_0#19 C?=C?_CAMIF_0#18 C?=C?_CAMIF_0#17 C?=C?_CAMIF_0#16 C?=C?_CAMIF_0#15 C?=C?_CAMIF_0#14 C?=C?_CAMIF_0#13 C?=C?_CAMIF_0#12 C?=C?_CAMIF_0#11 C?=C?_CAMIF_0#2 C?=C?_CAMIF_0#6 C?=C?_CAMIF_0#8 C?=C?_CAMIF_0#10 C?=C?_CAMIF_0#1 C?=C?_CAMIF_0#5 C?=C?_CAMIF_0#7 C?=C?_CAMIF_0#9 C?=C?_CAMIF_0#28 C?=C?_CAMIF_0#30 C?=C?_CAMIF_0#27 C?=C?_CAMIF_0#29 D?=D?_CAMIF_0#6 D?=D?_CAMIF_0#5 D?=D?_CAMIF_0#4 D?=D?_CAMIF_0#3 D?=D?_CAMIF_0#2 D?=D?_CAMIF_0#1 J?=J?_CAMIF_0#2 J?=J?_CAMIF_0#4 J?=J?_CAMIF_0#1 J?=J?_CAMIF_0#3 R?=R?_CAMIF_0#1 R?=R?_CAMIF_0#5 R?=R?_CAMIF_0#7 R?=R?_CAMIF_0#6 R?=R?_CAMIF_0#4 R?=R?_CAMIF_0#3 R?=R?_CAMIF_0#9 R?=R?_CAMIF_0#2 R?=R?_CAMIF_0#8 R?=R?_CAMIF_0#10 U?=U?_CAMIF_0#1 U?=U?_CAMIF_0#2 U?=U?_CAMIF_0#4 U?=U?_CAMIF_0#3 Y?=Y?_CAMIF_0; ports CAM_SCL=CAM_SCL_CAMIF_0 CAM_SDA=CAM_SDA_CAMIF_0 CKA_N=CKA_N_CAMIF_0 CKA_P=CKA_P_CAMIF_0 DA0_N=DA0_N_CAMIF_0 DA0_P=DA0_P_CAMIF_0 DA1_N=DA1_N_CAMIF_0 DA1_P=DA1_P_CAMIF_0
CAMIF_1: designators C?=C?_CAMIF_1#3 C?=C?_CAMIF_1#4 C?=C?_CAMIF_1#26 C?=C?_CAMIF_1#25 C?=C?_CAMIF_1#24 C?=C?_CAMIF_1#23 C?=C?_CAMIF_1#22 C?=C?_CAMIF_1#21 C?=C?_CAMIF_1#20 C?=C?_CAMIF_1#19 C?=C?_CAMIF_1#18 C?=C?_CAMIF_1#17 C?=C?_CAMIF_1#16 C?=C?_CAMIF_1#15 C?=C?_CAMIF_1#14 C?=C?_CAMIF_1#13 C?=C?_CAMIF_1#12 C?=C?_CAMIF_1#11 C?=C?_CAMIF_1#2 C?=C?_CAMIF_1#6 C?=C?_CAMIF_1#8 C?=C?_CAMIF_1#10 C?=C?_CAMIF_1#1 C?=C?_CAMIF_1#5 C?=C?_CAMIF_1#7 C?=C?_CAMIF_1#9 C?=C?_CAMIF_1#28 C?=C?_CAMIF_1#30 C?=C?_CAMIF_1#27 C?=C?_CAMIF_1#29 D?=D?_CAMIF_1#6 D?=D?_CAMIF_1#5 D?=D?_CAMIF_1#4 D?=D?_CAMIF_1#3 D?=D?_CAMIF_1#2 D?=D?_CAMIF_1#1 J?=J?_CAMIF_1#2 J?=J?_CAMIF_1#4 J?=J?_CAMIF_1#1 J?=J?_CAMIF_1#3 R?=R?_CAMIF_1#1 R?=R?_CAMIF_1#5 R?=R?_CAMIF_1#7 R?=R?_CAMIF_1#6 R?=R?_CAMIF_1#4 R?=R?_CAMIF_1#3 R?=R?_CAMIF_1#9 R?=R?_CAMIF_1#2 R?=R?_CAMIF_1#8 R?=R?_CAMIF_1#10 U?=U?_CAMIF_1#1 U?=U?_CAMIF_1#2 U?=U?_CAMIF_1#4 U?=U?_CAMIF_1#3 Y?=Y?_CAMIF_1; ports CAM_SCL=CAM_SCL_CAMIF_1 CAM_SDA=CAM_SDA_CAMIF_1 CKA_N=CKA_N_CAMIF_1 CKA_P=CKA_P_CAMIF_1 DA0_N=DA0_N_CAMIF_1 DA0_P=DA0_P_CAMIF_1 DA1_N=DA1_N_CAMIF_1 DA1_P=DA1_P_CAMIF_1

### Layout directives
differential pair: CKA_N_CAMIF_0, CKA_P_CAMIF_0, DA0_N_CAMIF_0, DA0_P_CAMIF_0, DA1_N_CAMIF_0, DA1_P_CAMIF_0, SIOA_N_CAMIF_0, SIOA_P_CAMIF_0, SIOB_N_CAMIF_0, SIOB_P_CAMIF_0, SIOC_N_CAMIF_0, SIOC_P_CAMIF_0, SIOD_N_CAMIF_0, SIOD_P_CAMIF_0, X25_N_CAMIF_0, X25_P_CAMIF_0

### Notes on the sheet
- CSI + I2C
- GMSL Aggregator
- COAX Inputs
- COAX is ok as 50ohm single ended but remove ground plane from under the pads of passives connected to the GMSL trace
- pullups?
- prob no since poc>>>>
- (near U?#1) Line fault?
- GMSL2 mode
- (near R?#6) COAX +
- (near R?#4) I2C ADDR 0x9E
- Table 7 and 8 of DS for CFG configs
- (near U?#2) Alas we require 1V2, 1V8, and 3V3 for these fuckers. Probably do buck for 3V3 and LDO for 1V2 and 1V8 but ask smarter humans first
- Maybe LDO for 3V3 would be worthwhile
- 1V2 & 1V8 LDOs
- PoC Supply
- Table 5 of gmsl2 hardware design guide from analog
- (in symbol CMP-015-00011-2, part A) 1 of 2
- (in symbol CMP-015-00011-2, part B) 2 of 2

### Library data of the parts
C?#1 C?#2 C?#5-C?#10 C?#28 C?#30 = CMP-2000-05393-2: Multilayer Ceramic Capacitors 100nF ±10% 50V X7R SMD 0402; Voltage: 50V; Dielectric Material: Ceramic; Min Operating Temperature: -55°C; Depth: 0.5mm; Radiation Hardening: No; RoHS Compliant: Yes; Voltage Rating (DC): 50V; Lead Free: Lead Free; Resistor Type: Ceramic; Height: 0.5mm; Dielectric: X7R; Thickness: 0.022inch; Case/Package: 0402; Case Code (Metric): 1005; Termination: SMD/SMT; Capacitance: 100nF; Packaging: Tape and Reel; Max Operating Temperature: 125°C; Mount: Surface Mount; Package Quantity: 1; Width: 0.02inch; Weight: 2.3E-05oz; Voltage Rating: 50V; Tolerance: 10%; Construction: Flat; Case Code (Imperial): 0402; Length: 1mm; REACH SVHC: No SVHC; Series: C
C?#3 C?#4 = CMP-1035-00914-3: CAP CER 30PF 50V 5% NP0 0603; Manufacturer: KEMET; Automotive Grade: Grade 1; Temperature Coefficient: 30ppm/°C; Material: Ceramic; Temperature Characteristic: C0G; Tolerance: 0.05; Description: C0603 30 pF C0G 30ppm/°C 5.00% 50 V; Manufacturer Part Number: C0603C300J5GACTU; ComponentLink2URL: https://api.kemet.com/component-edge/download/datasheet/C0603C100J5GACAUTO.pdf; Automotive: Yes; Device Class L2: Capacitors; Device Class L1: Passive Components; Device Class L3: Ceramic Capacitors; RoHS: TRUE; Octopart: https://octopart.com/c0603c300j5gactu-kemet-199455; Lead Free: Yes; Value: 30 pF; Temperature Range High: +125°C; Category: Cap; Temperature: -55°C to +125°C; Package: C0603C-CF; Capacitance: 30 pF; Digikey Description: CAP CER 30PF 50V 5% NP0 0603; Height: 0.87mm; ComponentLink2Description: Datasheet; Temperature Range Low: -55°C; Mouser Description: Multilayer Ceramic Capacitors MLCC - SMD/SMT 50volts 30pF C0G 5%; Voltage Rating: 50 V
C?#11 C?#13 C?#15 C?#17 C?#19 C?#21 C?#23 C?#25 C?#27 C?#29 = CMP-2006-02792-2: Chip Multilayer Ceramic Capacitors for General Purpose, 0603, 10uF, X5R, 15%, 20%, 6.3V; Packaging: Tape and Reel; Voltage Rating (DC): 6.3V; Width: 0.031inch; Termination: SMD/SMT; Dielectric: X5R; Package Quantity: 4000; Voltage Rating: 6.3V; Capacitance: 10uF; Case/Package: 0603; Min Operating Temperature: -55°C; Voltage: 6.3V; Length: 1.6mm; Thickness: 0.035inch; Lead Free: Lead Free; Depth: 0.8mm; Case Code (Imperial): 0603; Max Operating Temperature: 85°C; Material: Ceramic; Height: 0.8mm; Tolerance: 20%; Mount: Surface Mount; REACH SVHC: No SVHC; Radiation Hardening: No; Case Code (Metric): 1608
C?#12 C?#14 C?#16 C?#18 C?#20 C?#22 C?#24 C?#26 = CMP-03422-000327-1: CAP CER 10000PF 25V X7R 0603; Manufacturer: YAGEO; Tolerance: 0.1; Value: 10 nF; Temperature Coefficient: 15%; Material: Ceramic; Description: CC0603 10 nF X7R 10.00% 25 V; Lead Free: Yes; Temperature Range Low: -55°C; Mouser Description: Multilayer Ceramic Capacitors MLCC - SMD/SMT 10nF 25V X7R 10%; Device Class L1: Passive Components; RoHS: TRUE; Digikey Description: CAP CER 10000PF 25V X7R 0603; Capacitance: 10 nF; Temperature: -55°C to +125°C; Footprint Url: http://www.yageo.com/exep/pages/download/literatures/UPY-C_GEN_24.pdf; Category: Cap; ComponentLink2URL: http://www.yageo.com/documents/recent/UPY-GPHC_X7R_6.3V-to-50V_18.pdf; Octopart: https://octopart.com/cc0603krx7r8bb103-yageo-9288195; Temperature Characteristic: X7R; ComponentLink2Description: Datasheet; Voltage Rating: 25 V; Package: CC0603-DA; Automotive: No; Voltage: 25 V; Device Class L3: Ceramic Capacitors; Manufacturer Part Number: CC0603KRX7R8BB103; Device Class L2: Capacitors; Temperature Range High: +125°C; Height: 0.9mm
D?#1-D?#6 = CMP-32928-000003-1: TVS DIODE 5.5V 10V WLL-2-1; Manufacturer: Infineon; Number Of Channels: 1; Value: 3.5pF; Direction: Bidirectional; Peak Pulse Power: 132W; Peak Pulse Current: 12A; Temperature Range Low: -55°C; Automotive: No; Clamping Voltage: 10V; ComponentLink2Description: Datasheet; Lead Free: Yes; Octopart: https://octopart.com/esd231b1w0201e6327xtsa1-infineon-73507963; Mouser Description: 5.5V, 3.5pF, 0201, Bi-directional ESD/TVS Diode; Package: SG-WLL-2; Device Class L3: unset; Reverse Standoff Voltage: 5.5V; ComponentLink2URL: https://www.infineon.com/dgdl/Infineon-ESD231-B1-W0201-DS-v01_02-EN.pdf?fileId=5546d462503812bb0150854d4bac4c9d; Category: Diode; Device Class L2: TVS Diodes; Temperature Range High: +125°C; Manufacturer Part Number: ESD231B1W0201E6327XTSA1; Digikey Description: TVS DIODE 5.5V 10V WLL-2-1; Device Class L1: Circuit Protection; Temperature: -55°C to +125°C; Capacitance: 3.5pF; Footprint Url: https://www.infineon.com/cms/en/product/packages/SG-WLL/SG-WLL-2-1/; Height: 0.16mm; RoHS: TRUE
J?#1-J?#4 = CMP-002-00082-1: Male Asm, 1 Pos, R/a, Pcb, Fakra
R?#1 = CMP-2000-00484-1: Manufacturer: Panasonic; Part Number: ERJ-3EKF4020V
R?#2 R?#3 R?#8 R?#9 = CMP-2000-00538-1: Manufacturer: Panasonic; Part Number: ERJ-3EKF49R9V
R?#4 R?#6 = CMP-1012-00623-3: as R?#1 on sheet PWR_MGMT; Number of Pins: 2; Package Reference: 603; Depth: 0.8mm; Mount: SurfaceMount; Package Description: 2-Pin Surface Mount Device, Body 1.6 x 0.85 mm; Datasheet Version: 02/2017; Length: 1.6mm; Lead Free: LeadFree; Height: 0.45mm; Number of Terminations: 2; Max Power Dissipation: 100mW; Min Operating Temperature: -55degC; Datasheet URL: https://industrial.panasonic.com/cdbs/www-data/pdf/RDA0000/AOA0000C304.pdf; Termination: SMD/SMT; Case Code (Metric): 1608; Case Code (Imperial): 0603; Tolerance: 1%; Max Operating Temperature: 155degC; RoHSCompliant: true; Voltage Rating (DC): 75V; Radiation Hardening: No; Packaging: TapeandReel; Composition: ThickFilm; Mounting Technology: SurfaceMount; Manufacturer URL: http://www.panasonic.com/; Width: 0.031inch; REACH SVHC: NoSVHC; Contact Plating: Tin; Military Standard: Not; Package Quantity: 1
R?#5 = CMP-2000-00570-1: Manufacturer: Panasonic; Part Number: ERJ-3EKF5622V
R?#7 = CMP-2000-00508-1: Manufacturer: Panasonic; Part Number: ERJ-3EKF4422V
R?#10 = CMP-2000-00213-2: Chip Resistor, 120 Ohm, +/- 1%, 0.1 W, -55 to 155 degC, 0603 (1608 Metric), RoHS, Tape and Reel; Manufacturer: Panasonic; Power Rating: 100mW; Voltage Rating (DC): 75V; Resistance: 120Ohm; Temperature Coefficient: 100ppm/degreesC; Number of Terminations: 2; Military Standard: Not; Tolerance: 1%; Min Operating Temperature: -55degC; Packaging: TapeandReel; Lead Free: LeadFree; Max Operating Temperature: 155degC; Manufacturer URL: http://www.panasonic.com/; Case Code (Imperial): 0603; REACH SVHC: NoSVHC; Width: 0.031inch; Datasheet URL: https://industrial.panasonic.com/cdbs/www-data/pdf/RDA0000/AOA0000C283.pdf; RoHSCompliant: true; Max Power Dissipation: 100mW; Termination: SMD/SMT; Package Reference: 0603; Height: 0.022inch; Depth: 0.8mm; Package Description: 2-Pin Surface Mount Device, Body 1.6 x 0.85 mm; Contact Plating: Tin; Length: 1.6mm; Package URL: http://www.st.com/st-web-ui/static/active/en/resource/technical/document/datasheet/CD00001320.pdf; Radiation Hardening: No; Package Quantity: 1; Number of Pins: 2; Datasheet Version: 42095.0; Voltage Rating: 75V; Composition: ThickFilm; Case/Package: 0603; Mount: SurfaceMount; Case Code (Metric): 1608
U?#1 U?#2 = CMP-015-00011-2: Quad Tunneling GMSL2/1 to CSI-2 Deserializer
U?#3 = CMP-0244-00308-1: Fixed Low Drop Positive Voltage Regulator, 1.8V, 4-Pin SOT-223, Tape and Reel; ComponentLink1URL: http://www.st.com; PackageReference: SOT-223; PackageDescription: 4-Pin SOT-223 Package, 6.5 x 3.5 mm Body, 2.3 mm Pitch, 7 mm Lead Span; ComponentLink2URL: http://www.st.com/internet/com/TECHNICAL_RESOURCES/TECHNICAL_LITERATURE/DATASHEET/CD00000544.pdf; ComponentLink2Description: Datasheet; ComponentLink1Description: Manufacturer URL; DatasheetVersion: 1/11/2011; PackageVersion: 2010
U?#4 = CMP-0244-00318-1: Fixed Low Drop Positive Voltage Regulator, 1.2V, 4-Pin SOT-223, Tape and Reel; PackageDescription: 4-Pin SOT-223 Package, 6.5 x 3.5 mm Body, 2.3 mm Pitch, 7 mm Lead Span; PackageVersion: 2010; ComponentLink2Description: Datasheet; PackageReference: SOT-223; ComponentLink2URL: http://www.st.com/internet/com/TECHNICAL_RESOURCES/TECHNICAL_LITERATURE/DATASHEET/CD00000544.pdf; ComponentLink1Description: Manufacturer URL; DatasheetVersion: 1/11/2011; ComponentLink1URL: http://www.st.com
Y? = CMP-2000-05733-3: Crystal 25MHz ±20ppm (Tol) ±30ppm (Stability) 18pF FUND 60Ω 4-Pin SMD T/R; Series Resistance: 60R; Length: 3.2mm; Depth: 2.5mm; Packaging: Tape and Reel; Min Operating Temperature: -40°C; Operating Frequency: 25 MHz; Lead Free: Lead Free; Number of Pins: 4; Frequency Tolerance: 20ppm; Radiation Hardening: No; Max Operating Temperature: 85°C; Termination: SMD/SMT; Frequency Stability: 30ppm; Frequency: 25MHz; Series: ABM8G; Mount: Surface Mount; Package Quantity: 1000; Height: 0.039inch; Width: 0.098inch; Case/Package: CSMD; ESR (Equivalent Series Resistance): 60R; Load Capacitance: 18pF; Tolerance: 20ppm

## Sheet JETSON.SchDoc
size D; SheetNumber: 3; SheetTotal: 9
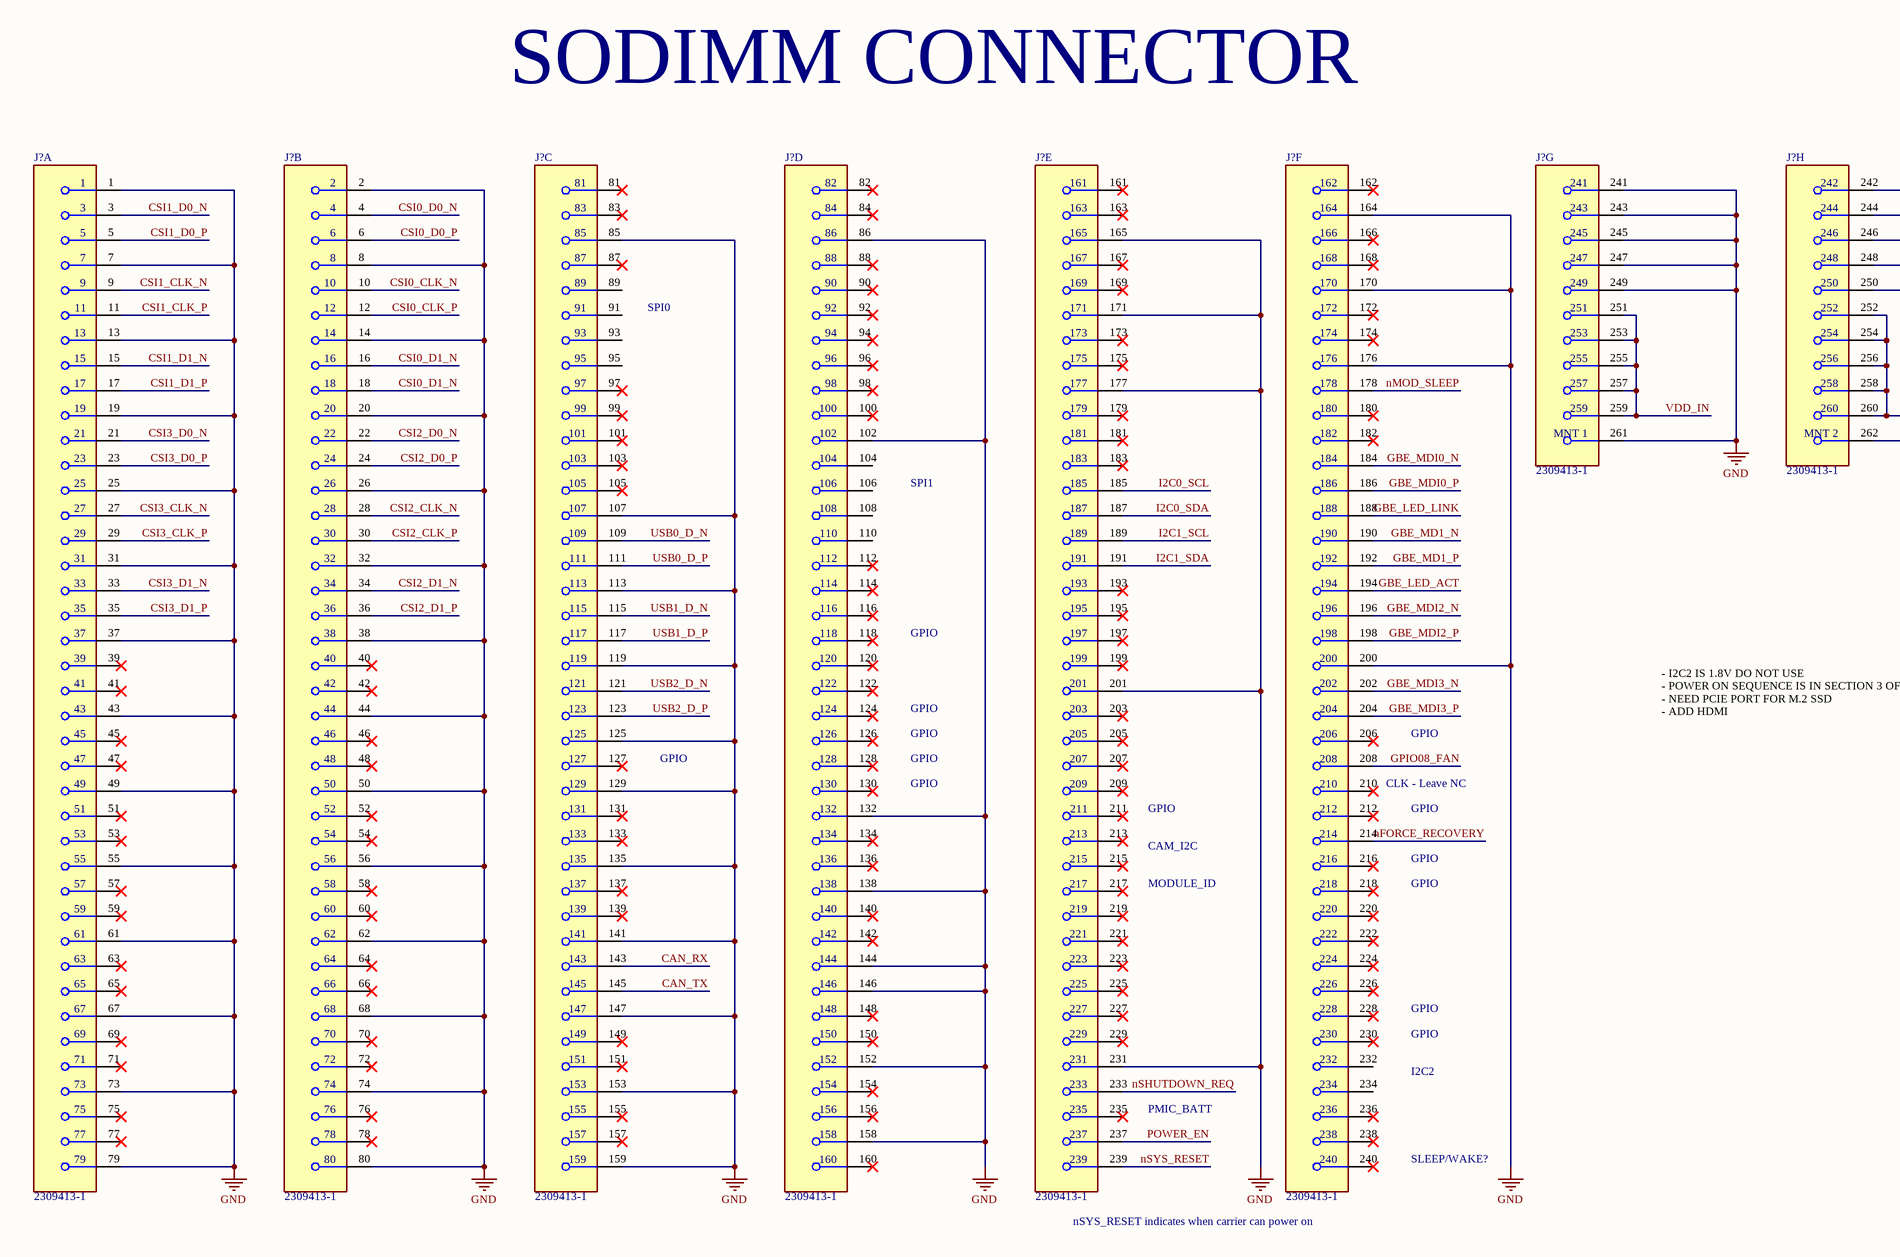
[diagram p4: JETSON.SchDoc, top left]
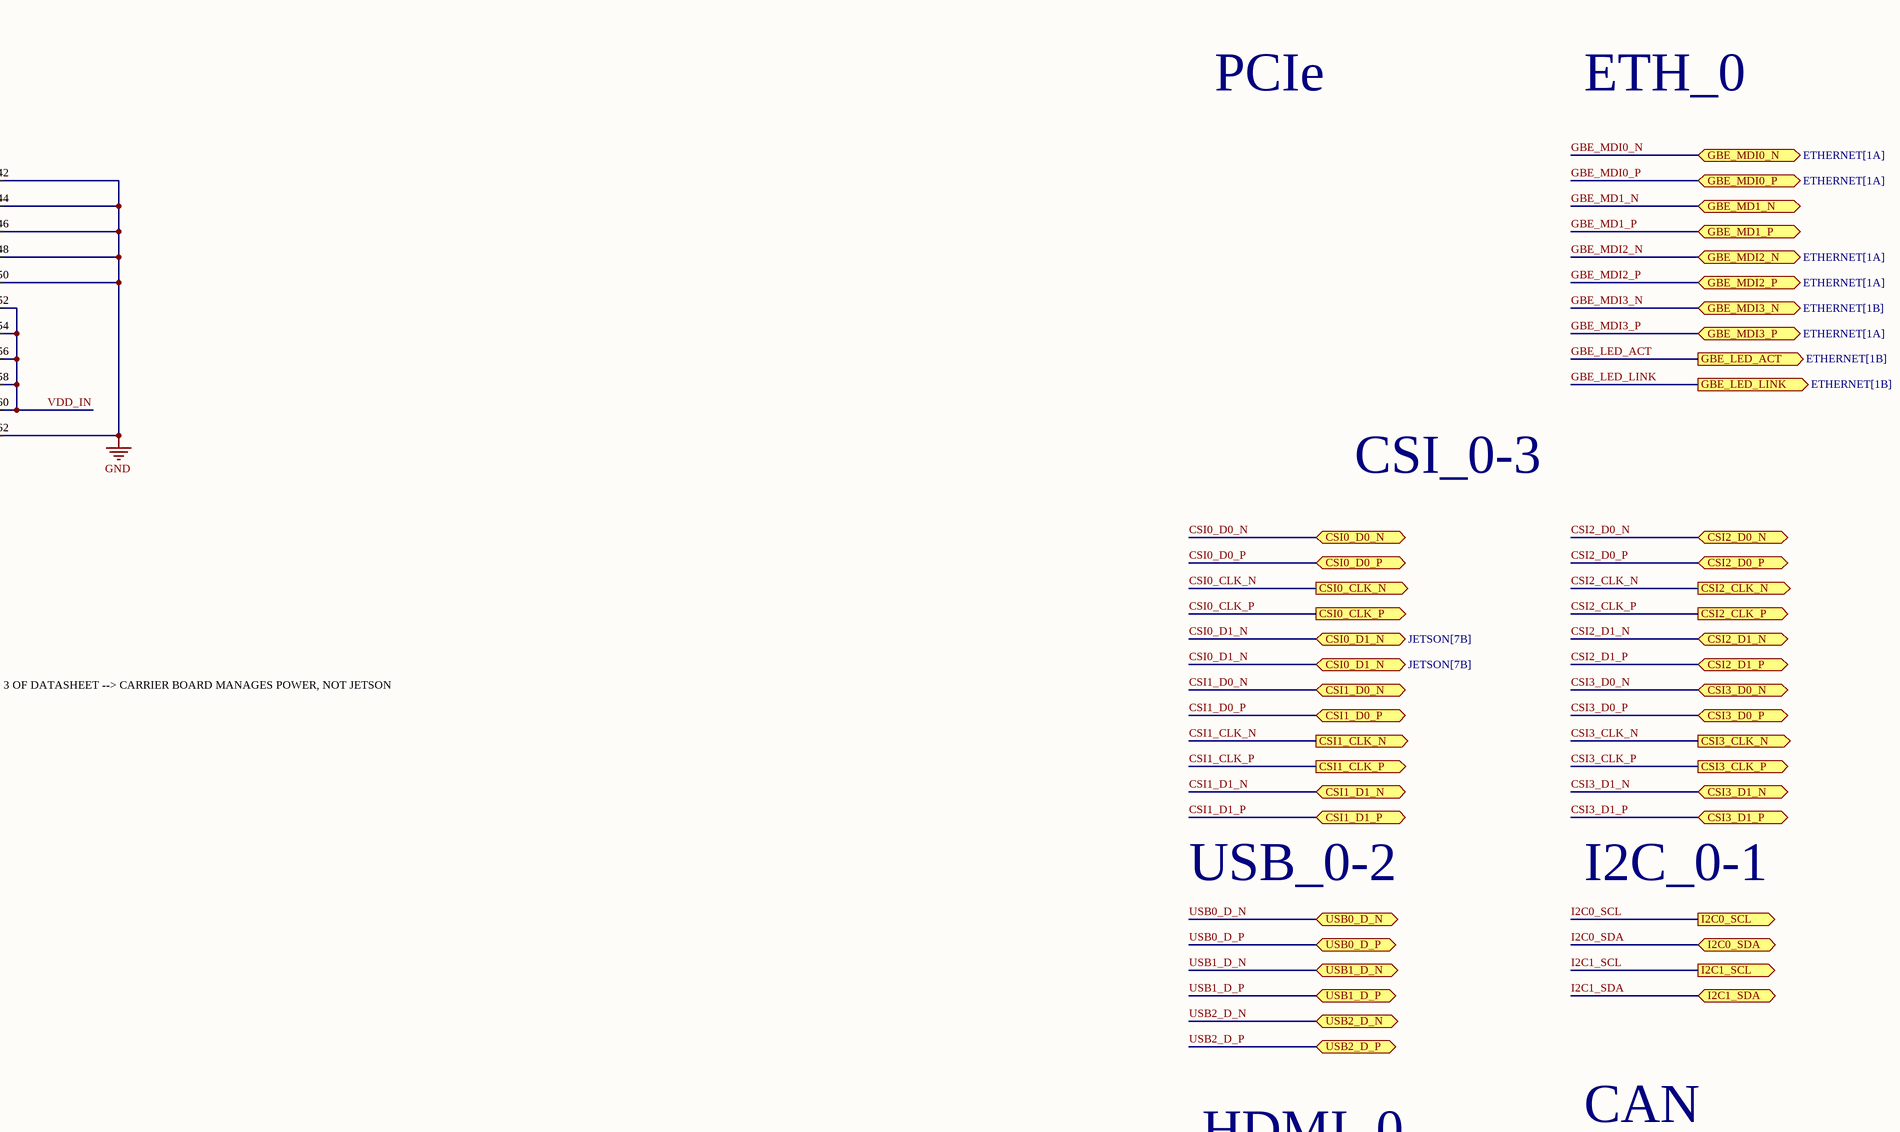
[diagram p5: JETSON.SchDoc, top right]
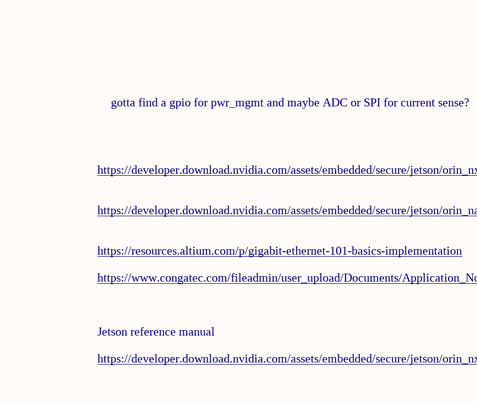
[diagram p6: JETSON.SchDoc, bottom left]
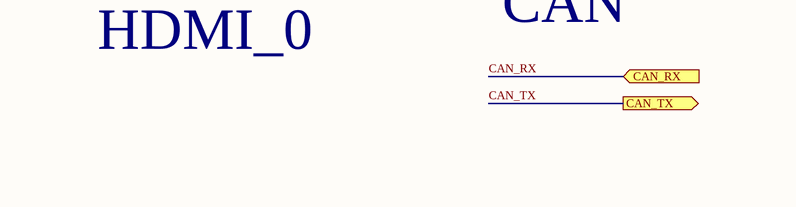
[diagram p7: JETSON.SchDoc, bottom right]

### Parts
(Parts that share a designator on the sheet are numbered #1, #2 ... from top to bottom, then left to right.)
J?#1  2309413-1  [FP-2309413-1-MFG]  (part A of 8)
J?#2  2309413-1  [FP-2309413-1-MFG]  (part B of 8)
J?#3  2309413-1  [FP-2309413-1-MFG]  (part C of 8)
J?#4  2309413-1  [FP-2309413-1-MFG]  (part D of 8)
J?#5  2309413-1  [FP-2309413-1-MFG]  (part E of 8)
J?#6  2309413-1  [FP-2309413-1-MFG]  (part F of 8)
J?#7  2309413-1  [FP-2309413-1-MFG]  (part G of 8)
J?#8  2309413-1  [FP-2309413-1-MFG]  (part H of 8)

### Ports
CAN_RX (in), CAN_TX (out), CSI0_CLK_N (out), CSI0_CLK_P (out), CSI0_D0_N (bidir), CSI0_D0_P (bidir), CSI0_D1_N (bidir, see JETSON[7B]), CSI1_CLK_N (out), CSI1_CLK_P (out), CSI1_D0_N (bidir), CSI1_D0_P (bidir), CSI1_D1_N (bidir), CSI1_D1_P (bidir), CSI2_CLK_N (out), CSI2_CLK_P (out), CSI2_D0_N (bidir), CSI2_D0_P (bidir), CSI2_D1_N (bidir), CSI2_D1_P (bidir), CSI3_CLK_N (out), CSI3_CLK_P (out), CSI3_D0_N (bidir), CSI3_D0_P (bidir), CSI3_D1_N (bidir), CSI3_D1_P (bidir), GBE_LED_ACT (out, see ETHERNET[1B]), GBE_LED_LINK (out, see ETHERNET[1B]), GBE_MD1_N (bidir), GBE_MD1_P (bidir), GBE_MDI0_N (bidir, see ETHERNET[1A]), GBE_MDI0_P (bidir, see ETHERNET[1A]), GBE_MDI2_N (bidir, see ETHERNET[1A]), GBE_MDI2_P (bidir, see ETHERNET[1A]), GBE_MDI3_N (bidir, see ETHERNET[1B]), GBE_MDI3_P (bidir, see ETHERNET[1A]), I2C0_SCL (out), I2C0_SDA (bidir), I2C1_SCL (out), I2C1_SDA (bidir), USB0_D_N (bidir), USB0_D_P (bidir), USB1_D_N (bidir), USB1_D_P (bidir), USB2_D_N (bidir), USB2_D_P (bidir)

### Nets
GND: J?#1.1 J?#1.7 J?#1.13 J?#1.19 J?#1.25 J?#1.31 J?#1.37 J?#1.43 J?#1.49 J?#1.55 J?#1.61 J?#1.67 J?#1.73 J?#1.79 J?#2.2 J?#2.8 J?#2.14 J?#2.20 J?#2.26 J?#2.32 J?#2.38 J?#2.44 J?#2.50 J?#2.56 J?#2.62 J?#2.68 J?#2.74 J?#2.80 J?#3.85 J?#3.107 J?#3.113 J?#3.119 J?#3.125 J?#3.129 J?#3.135 J?#3.141 J?#3.147 J?#3.153 J?#3.159 J?#4.86 J?#4.102 J?#4.132 J?#4.138 J?#4.144 J?#4.146 J?#4.152 J?#4.158 J?#5.165 J?#5.171 J?#5.177 J?#5.201 J?#5.231 J?#6.164 J?#6.170 J?#6.176 J?#6.200 J?#7.241 J?#7.243 J?#7.245 J?#7.247 J?#7.249 J?#7.261(MNT_1) J?#8.242 J?#8.244 J?#8.246 J?#8.248 J?#8.250 J?#8.262(MNT_2)
CAN_RX: J?#3.143 ; port CAN_RX
CAN_TX: J?#3.145 ; port CAN_TX
CSI0_CLK_N: J?#2.10 ; port CSI0_CLK_N
CSI0_CLK_P: J?#2.12 ; port CSI0_CLK_P
CSI0_D0_N: J?#2.4 ; port CSI0_D0_N
CSI0_D0_P: J?#2.6 ; port CSI0_D0_P
CSI0_D1_N: J?#2.16 J?#2.18 ; port CSI0_D1_N
CSI1_CLK_N: J?#1.9 ; port CSI1_CLK_N
CSI1_CLK_P: J?#1.11 ; port CSI1_CLK_P
CSI1_D0_N: J?#1.3 ; port CSI1_D0_N
CSI1_D0_P: J?#1.5 ; port CSI1_D0_P
CSI1_D1_N: J?#1.15 ; port CSI1_D1_N
CSI1_D1_P: J?#1.17 ; port CSI1_D1_P
CSI2_CLK_N: J?#2.28 ; port CSI2_CLK_N
CSI2_CLK_P: J?#2.30 ; port CSI2_CLK_P
CSI2_D0_N: J?#2.22 ; port CSI2_D0_N
CSI2_D0_P: J?#2.24 ; port CSI2_D0_P
CSI2_D1_N: J?#2.34 ; port CSI2_D1_N
CSI2_D1_P: J?#2.36 ; port CSI2_D1_P
CSI3_CLK_N: J?#1.27 ; port CSI3_CLK_N
CSI3_CLK_P: J?#1.29 ; port CSI3_CLK_P
CSI3_D0_N: J?#1.21 ; port CSI3_D0_N
CSI3_D0_P: J?#1.23 ; port CSI3_D0_P
CSI3_D1_N: J?#1.33 ; port CSI3_D1_N
CSI3_D1_P: J?#1.35 ; port CSI3_D1_P
GBE_LED_ACT: J?#6.194 ; port GBE_LED_ACT
GBE_LED_LINK: J?#6.188 ; port GBE_LED_LINK
GBE_MD1_N: J?#6.190 ; port GBE_MD1_N
GBE_MD1_P: J?#6.192 ; port GBE_MD1_P
GBE_MDI0_N: J?#6.184 ; port GBE_MDI0_N
GBE_MDI0_P: J?#6.186 ; port GBE_MDI0_P
GBE_MDI2_N: J?#6.196 ; port GBE_MDI2_N
GBE_MDI2_P: J?#6.198 ; port GBE_MDI2_P
GBE_MDI3_N: J?#6.202 ; port GBE_MDI3_N
GBE_MDI3_P: J?#6.204 ; port GBE_MDI3_P
GPIO08_FAN: J?#6.208
I2C0_SCL: J?#5.185 ; port I2C0_SCL
I2C0_SDA: J?#5.187 ; port I2C0_SDA
I2C1_SCL: J?#5.189 ; port I2C1_SCL
I2C1_SDA: J?#5.191 ; port I2C1_SDA
nFORCE_RECOVERY: J?#6.214
nMOD_SLEEP: J?#6.178
nSHUTDOWN_REQ: J?#5.233
nSYS_RESET: J?#5.239
POWER_EN: J?#5.237
USB0_D_N: J?#3.109 ; port USB0_D_N
USB0_D_P: J?#3.111 ; port USB0_D_P
USB1_D_N: J?#3.115 ; port USB1_D_N
USB1_D_P: J?#3.117 ; port USB1_D_P
USB2_D_N: J?#3.121 ; port USB2_D_N
USB2_D_P: J?#3.123 ; port USB2_D_P
VDD_IN: J?#7.251 J?#7.253 J?#7.255 J?#7.257 J?#7.259 J?#8.252 J?#8.254 J?#8.256 J?#8.258 J?#8.260

Not connected (* = marked no-connect by the designer): J?#1 39* 41* 45* 47* 51* 53* 57* 59* 63* 65* 69* 71* 75* 77*; J?#2 40* 42* 46* 48* 52* 54* 58* 60* 64* 66* 70* 72* 76* 78*; J?#3 81* 83* 87* 89 91 93 95 97* 99* 101* 103* 105* 127* 131* 133* 137* 139* 149* 151* 155* 157*; J?#4 82* 84* 88* 90* 92* 94* 96* 98* 100* 104 106 108 110 112* 114* 116* 118* 120* 122* 124* 126* 128* 130* 134* 136* 140* 142* 148* 150* 154* 156* 160*; J?#5 161* 163* 167* 169* 173* 175* 179* 181* 183* 193* 195* 197* 199* 203* 205* 207* 209* 211* 213* 215* 217* 219* 221* 223* 225* 227* 229* 235*; J?#6 162* 166* 168* 172* 174* 180* 182* 206* 210* 212* 216* 218* 220* 222* 224* 226* 228* 230* 232 234 236* 238* 240*

### Notes on the sheet
- SODIMM CONNECTOR
- PCIe
- ETH_0
- SPI0
- SPI1
- CSI_0-3
- GPIO
- (near J?#6) CLK - Leave NC
- CAM_I2C
- MODULE_ID
- USB_0-2
- I2C_0-1
- - I2C2 IS 1.8V DO NOT USE
  - POWER ON SEQUENCE IS IN SECTION 3 OF DATASHEET --> CARRIER BOARD MANAGES POWER, NOT JETSON
  - NEED PCIE PORT FOR M.2 SSD
  - ADD HDMI
- PMIC_BATT
- I2C2
- CAN
- SLEEP/WAKE?
- HDMI_0
- nSYS_RESET indicates when carrier can power on
- gotta find a gpio for pwr_mgmt and maybe ADC or SPI for current sense?
- https://developer.download.nvidia.com/assets/embedded/secure/jetson/orin_nx/docs/Jetson-Orin-NX-Series-Modules-Data-Sheet_DS-10712-001_v1.1.pdf?qhjqqJOfVnHCM-1XF3yIQpd2xfOOHwmcgVwMEoYJ7MxLV6htvBcCQBAWi_BDO8yBEWslRcUaReucjDkH91McAghWwJmYjhTJoVoEUvLFgX583-qKr_REPRGUalLshQ-DeOK5XvySH5OmW4RDnQayRqIhzIBBSUWPjFaWLdJjM1JhWiyI3hM5VtWcQCIuw7hGP4sJ7ZLCMgQXeMz6eFhUxr5xiOQPPyQ1&t=eyJscyI6ImdzZW8iLCJsc2QiOiJodHRwczovL3d3dy5nb29nbGUuY29tLyJ9
- https://developer.download.nvidia.com/assets/embedded/secure/jetson/orin_nano/docs/Jetson-Orin-Nano-Series-Modules-Data-Sheet_DS-11105-001_v1.2.pdf?jdQi_j839Sjggjj5QTF3_oOgnPN2J2ewz7Km2q-aLyRAS0YMswcsS8demvG6kdssXTo3By--j94fp-O5W54ShkpP0OL6Z16cXsATsCs5kVxLQzyDWp4PJJSuB9S5pyMOEFmtw_tlPL_Gy2oPuhK_UbNdkrgh1dCA55zEuK928asFQhAHapZ0s__KiE7erU3EBWJIZ94vBC5BwytStbskK9hDtogPdFhuGCQNTg==&t=eyJscyI6ImdzZW8iLCJsc2QiOiJodHRwczovL3d3dy5nb29nbGUuY29tLyJ9
- https://resources.altium.com/p/gigabit-ethernet-101-basics-implementation
- https://www.congatec.com/fileadmin/user_upload/Documents/Application_Notes/AN43_M.2_Pinout_Descriptions_and_Reference_Designs.pdf
- https://developer.download.nvidia.com/assets/embedded/secure/jetson/orin_nx/docs/DG-10931-001_v1.2.pdf?a9ej-2Bw8ItDc1cnJp_Orjmj0ruhafQwJG7pHYeyXv2gwzFspQ0ZbPaHE0IwtPv6h2NAYJaZXDoFolUZ5Iw8vU13fA-kLmHK94KlPsyvaeFIbWePzp1X10HDT7HvJCgNl1WkV_8WJp9-smZyxlSW_wKeuMdy5xgzu_0wxoi4gg==&t=eyJscyI6ImdzZW8iLCJsc2QiOiJodHRwczovL3d3dy5nb29nbGUuY29tLyJ9
- Jetson reference manual

### Library data of the parts
J?#1-J?#8 = CMP-03356-000001-1: DDR4 SODIMM 260P 9.2H STD; Manufacturer: TE Connectivity; Voltage Rating: 25V; Current Rating: 0.5A; Is Female: yes; Pitch: 0.5mm; Memory Type: SDRAM,DDR; Conn Orientation: Horizontal; Number Of Contacts: 260; Temperature: -55°C to +85°C; Octopart: https://octopart.com/2309413-1-te+connectivity-84799194; Device Class L3: unset; Contact Material: Gold,Nickel; ComponentLink2URL: https://www.te.com/commerce/DocumentDelivery/DDEController?Action=showdoc&DocId=Specification+Or+Standard%7F108-115122%7FA1%7Fpdf%7FEnglish%7FENG_SS_108-115122_A1.pdf%7F2309413-1; Manufacturer Part Number: 2309413-1; ComponentLink2Description: Datasheet; Digikey Description: DDR4 SODIMM 260P 9.2H STD; Height: 18.8mm; Footprint Url: https://www.te.com/commerce/DocumentDelivery/DDEController?Action=showdoc&DocId=Customer+Drawing%7F2309413%7F4%7Fpdf%7FEnglish%7FENG_CD_2309413_4.pdf%7F2309413-1; Temperature Range Low: -55°C; Device Class L2: Memory Connectors; Temperature Range High: +85°C; RoHS: TRUE; Automotive: No; Device Class L1: Connectors; Mouser Description: Conn DDR4 DIMM Socket SKT 260 POS 0.5mm Solder RA SMD T/R; Category: Conn; Package: 0; Lead Free: Yes

## Sheet USB.SchDoc
size A4; SheetNumber: 6; SheetTotal: 6
Used 3 times, as channels USB0, USB1, USB2. Parts and nets are listed once, with the designators drawn on the sheet.

### Channels
USB0: no parts or ports
USB1: no parts or ports
USB2: no parts or ports